# Altium project PiMX8MP_r0.3_release.PrjPcb (part 1 of 6)
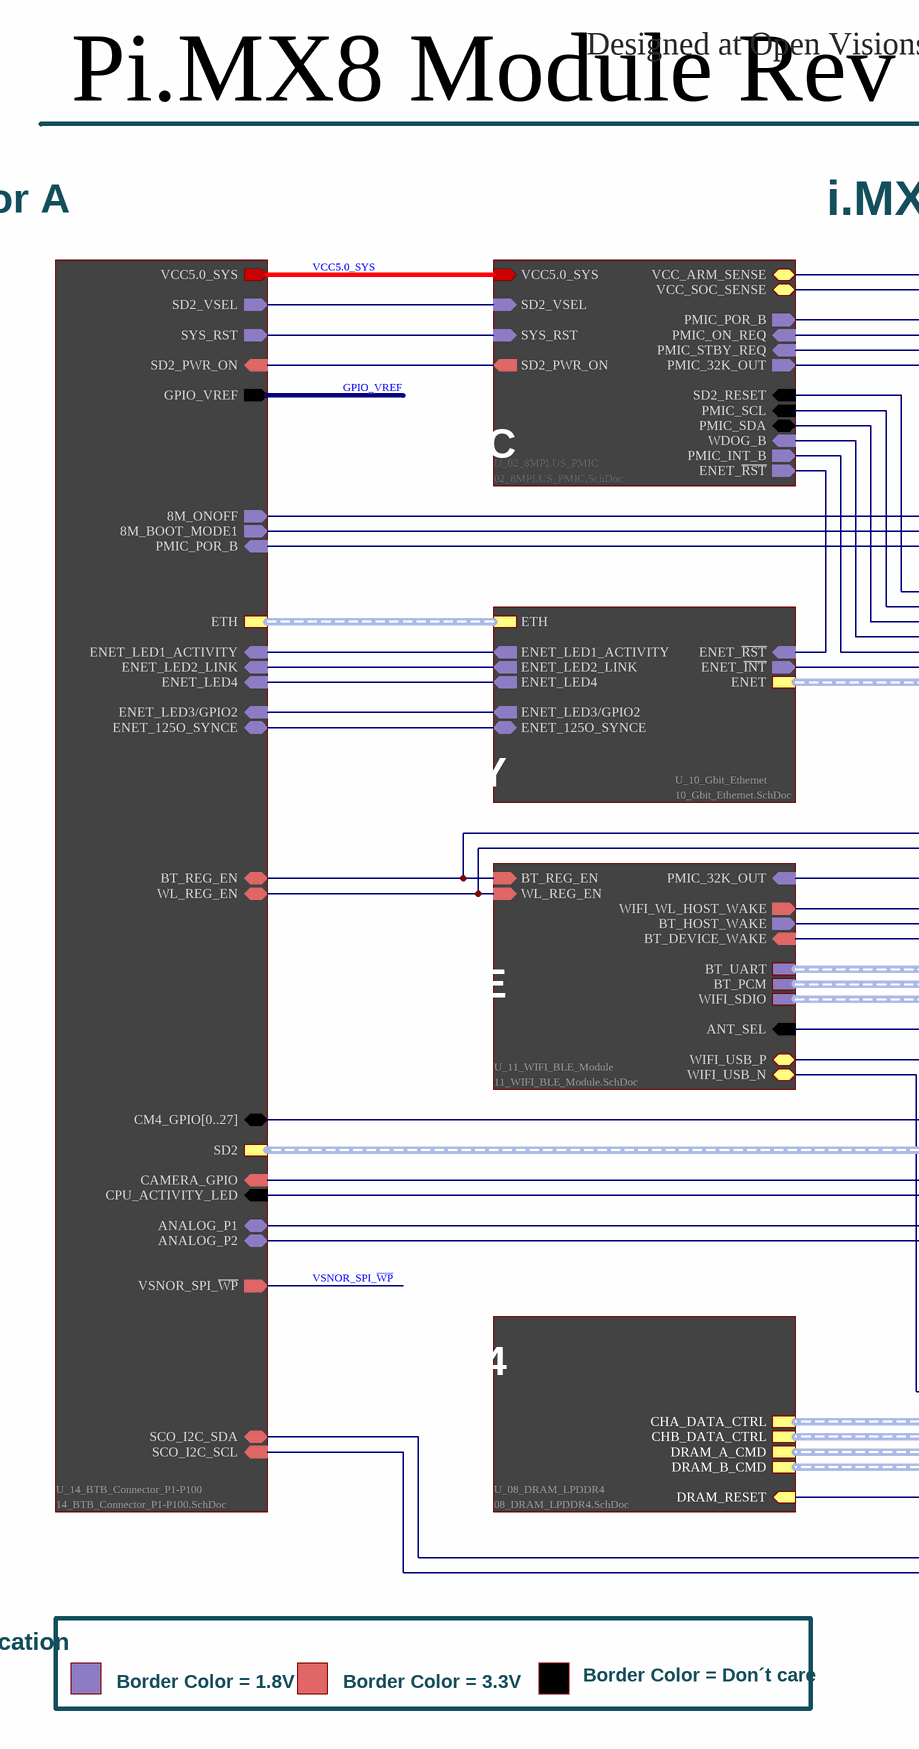
[diagram p0: 01_Block_Diagram.SchDoc, left]
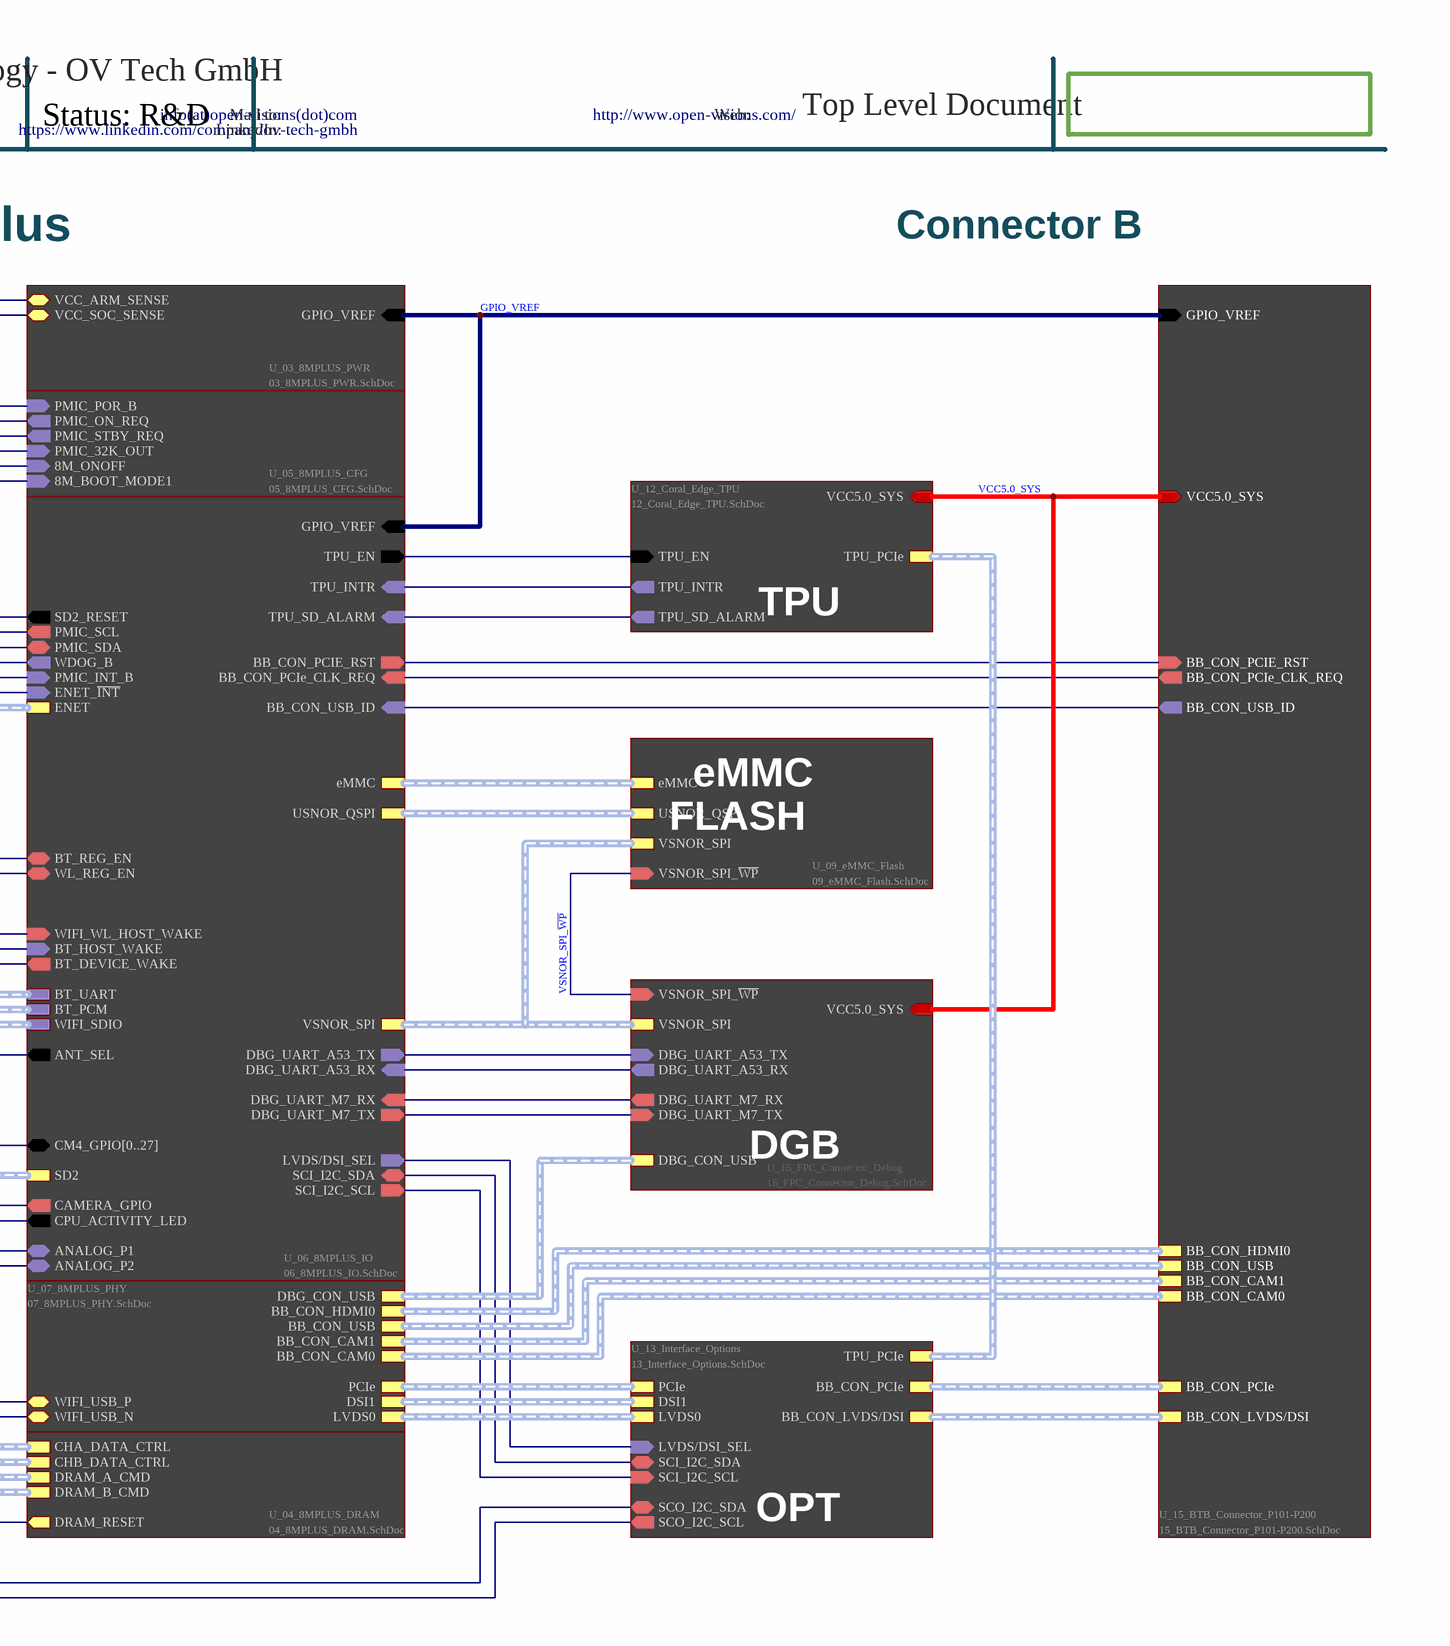
[diagram p1: 01_Block_Diagram.SchDoc, right]
Customer: OV Tech GmbH; DevStatus: Release; License: CERN-OHL-S-2.0; Reviewer: T. Ludemann; Revision: 0.3
16 sheets, 561 parts. Net scope: hierarchical (ports join the sheet entries above them; power ports are global).
Board file: PiMX8MP_r0.3.PcbDoc
Sheets:
  01_Block_Diagram.SchDoc
    U_02_8MPLUS_PMIC = 02_8MPLUS_PMIC.SchDoc
    U_03_8MPLUS_PWR = 03_8MPLUS_PWR.SchDoc
    U_04_8MPLUS_DRAM = 04_8MPLUS_DRAM.SchDoc
    U_05_8MPLUS_CFG = 05_8MPLUS_CFG.SchDoc
    U_06_8MPLUS_IO = 06_8MPLUS_IO.SchDoc
    U_07_8MPLUS_PHY = 07_8MPLUS_PHY.SchDoc
    U_08_DRAM_LPDDR4 = 08_DRAM_LPDDR4.SchDoc
    U_09_eMMC_Flash = 09_eMMC_Flash.SchDoc
    U_10_Gbit_Ethernet = 10_Gbit_Ethernet.SchDoc
    U_11_WIFI_BLE_Module = 11_WIFI_BLE_Module.SchDoc
    U_12_Coral_Edge_TPU = 12_Coral_Edge_TPU.SchDoc
    U_13_Interface_Options = 13_Interface_Options.SchDoc
    U_14_BTB_Connector_P1-P100 = 14_BTB_Connector_P1-P100.SchDoc
    U_15_BTB_Connector_P101-P200 = 15_BTB_Connector_P101-P200.SchDoc
    U_16_FPC_Connector_Debug = 16_FPC_Connector_Debug.SchDoc

## Sheet 01_Block_Diagram.SchDoc: Block_Diagram
size 420 x 297 mm; Author: Lukas Henkel; DocumentNumber: 1; SheetNumber: 1; SheetTotal: 16; DocSize: A3

### Parts
(Parts that share a designator on the sheet are numbered #1, #2 ... from top to bottom, then left to right.)
?#1  (no value)  (graphical)

### Sub-sheets
U_02_8MPLUS_PMIC = 02_8MPLUS_PMIC.SchDoc: VCC_ARM_SENSE (bidir), VCC_SOC_SENSE (bidir), VCC5.0_SYS (in), SD2_VSEL (in), SYS_RST (in), PMIC_ON_REQ (in), PMIC_STBY_REQ (in), WDOG_B (in), PMIC_SCL (in), PMIC_SDA (bidir), PMIC_POR_B (out), PMIC_INT_B (out), PMIC_32K_OUT (out), SD2_PWR_ON (out), SD2_RESET (in), ENET_~{RST} (out)
U_03_8MPLUS_PWR = 03_8MPLUS_PWR.SchDoc: VCC_ARM_SENSE (bidir), VCC_SOC_SENSE (bidir), GPIO_VREF (in)
U_04_8MPLUS_DRAM = 04_8MPLUS_DRAM.SchDoc: CHA_DATA_CTRL (harness CHA_DATA_CTRL), CHB_DATA_CTRL (harness CHB_DATA_CTRL), DRAM_A_CMD (harness DRAM_A_CMD), DRAM_B_CMD (harness DRAM_B_CMD), DRAM_RESET (out)
U_05_8MPLUS_CFG = 05_8MPLUS_CFG.SchDoc: 8M_ONOFF (in), PMIC_POR_B (in), PMIC_ON_REQ (out), PMIC_STBY_REQ (out), PMIC_32K_OUT (in), 8M_BOOT_MODE1 (in)
U_06_8MPLUS_IO = 06_8MPLUS_IO.SchDoc: ENET (harness ENET), SD2 (harness SD2), SD2_RESET (out), ENET_~{INT} (in), WDOG_B (out), PMIC_INT_B (in), WIFI_SDIO (harness WIFI_SDIO), BT_HOST_WAKE (in), BT_DEVICE_WAKE (out), BT_UART (harness BT_UART), BT_PCM (harness BT_PCM), eMMC (harness eMMC), USNOR_QSPI (harness USNOR_QSPI), VSNOR_SPI (harness VSNOR_SPI), TPU_INTR (in), TPU_SD_ALARM (in), WIFI_WL_HOST_WAKE (in), ANT_SEL (out), BB_CON_PCIE_RST (out), BB_CON_PCIe_CLK_REQ (in), SCI_I2C_SDA (bidir), SCI_I2C_SCL (out), CM4_GPIO[0..27] (bidir), ANALOG_P1 (bidir), ANALOG_P2 (bidir), CAMERA_GPIO (out), BB_CON_USB_ID (in), DBG_UART_M7_TX (out), DBG_UART_M7_RX (in), DBG_UART_A53_TX (out), DBG_UART_A53_RX (in), CPU_ACTIVITY_LED (out), GPIO_VREF (in), PMIC_SCL (out), PMIC_SDA (bidir), LVDS/DSI_SEL (out), TPU_EN (out), WL_REG_EN (bidir), BT_REG_EN (bidir)
U_07_8MPLUS_PHY = 07_8MPLUS_PHY.SchDoc: BB_CON_HDMI0 (harness BB_CON_HDMI0), BB_CON_USB (harness BB_CON_USB), PCIe (harness PCIe), BB_CON_CAM1 (harness BB_CON_CAM1), BB_CON_CAM0 (harness BB_CON_CAM0), DSI1 (harness DSI1), LVDS0 (harness LVDS0), DBG_CON_USB (harness DBG_CON_USB), WIFI_USB_P (bidir), WIFI_USB_N (bidir)
U_08_DRAM_LPDDR4 = 08_DRAM_LPDDR4.SchDoc: DRAM_A_CMD (harness DRAM_A_CMD), DRAM_B_CMD (harness DRAM_B_CMD), DRAM_RESET (in), CHA_DATA_CTRL (harness CHA_DATA_CTRL), CHB_DATA_CTRL (harness CHB_DATA_CTRL)
U_09_eMMC_Flash = 09_eMMC_Flash.SchDoc: eMMC (harness eMMC), USNOR_QSPI (harness USNOR_QSPI), VSNOR_SPI (harness VSNOR_SPI), VSNOR_SPI_~{WP} (in)
U_10_Gbit_Ethernet = 10_Gbit_Ethernet.SchDoc: ENET (harness ENET), ENET_~{RST} (in), ENET_~{INT} (out), ETH (harness ETH), ENET_LED4 (out), ENET_LED1_ACTIVITY (out), ENET_LED2_LINK (out), ENET_125O_SYNCE (bidir), ENET_LED3/GPIO2 (out)
U_11_WIFI_BLE_Module = 11_WIFI_BLE_Module.SchDoc: ANT_SEL (in), BT_UART (harness BT_UART), WIFI_WL_HOST_WAKE (out), BT_PCM (harness BT_PCM), WIFI_SDIO (harness WIFI_SDIO), BT_HOST_WAKE (out), BT_DEVICE_WAKE (in), BT_REG_EN (in), WL_REG_EN (in), WIFI_USB_P (bidir), WIFI_USB_N (bidir), PMIC_32K_OUT (in)
U_12_Coral_Edge_TPU = 12_Coral_Edge_TPU.SchDoc: VCC5.0_SYS (in), TPU_EN (in), TPU_INTR (out), TPU_SD_ALARM (out), TPU_PCIe (harness TPU_PCIe)
U_13_Interface_Options = 13_Interface_Options.SchDoc: PCIe (harness PCIe), TPU_PCIe (harness TPU_PCIe), BB_CON_PCIe (harness BB_CON_PCIe), BB_CON_LVDS/DSI (harness BB_CON_LVDS/DSI), DSI1 (harness DSI1), LVDS0 (harness LVDS0), LVDS/DSI_SEL (in), SCI_I2C_SDA (bidir), SCI_I2C_SCL (in), SCO_I2C_SCL (out), SCO_I2C_SDA (bidir)
U_14_BTB_Connector_P1-P100 = 14_BTB_Connector_P1-P100.SchDoc: ETH (harness ETH), ENET_LED4 (in), ENET_LED1_ACTIVITY (in), ENET_LED2_LINK (in), CPU_ACTIVITY_LED (in), ENET_125O_SYNCE (bidir), ENET_LED3/GPIO2 (in), VSNOR_SPI_~{WP} (out), SD2_PWR_ON (in), VCC5.0_SYS (out), BT_REG_EN (bidir), WL_REG_EN (bidir), 8M_BOOT_MODE1 (out), CAMERA_GPIO (in), 8M_ONOFF (out), SD2 (harness SD2), SD2_VSEL (out), GPIO_VREF (out), PMIC_POR_B (in), ANALOG_P1 (bidir), ANALOG_P2 (bidir), CM4_GPIO[0..27] (bidir), SCO_I2C_SCL (in), SCO_I2C_SDA (bidir), SYS_RST (out)
U_15_BTB_Connector_P101-P200 = 15_BTB_Connector_P101-P200.SchDoc: BB_CON_USB (harness BB_CON_USB), BB_CON_USB_ID (out), BB_CON_PCIe (harness BB_CON_PCIe), BB_CON_PCIe_CLK_REQ (out), BB_CON_PCIE_RST (in), BB_CON_CAM1 (harness BB_CON_CAM1), BB_CON_CAM0 (harness BB_CON_CAM0), VCC5.0_SYS (in), BB_CON_HDMI0 (harness BB_CON_HDMI0), BB_CON_LVDS/DSI (harness BB_CON_LVDS/DSI), GPIO_VREF (in)
U_16_FPC_Connector_Debug = 16_FPC_Connector_Debug.SchDoc: DBG_CON_USB (harness DBG_CON_USB), DBG_UART_A53_TX (in), DBG_UART_A53_RX (out), VSNOR_SPI (harness VSNOR_SPI), VSNOR_SPI_~{WP} (in), VCC5.0_SYS (in), DBG_UART_M7_TX (in), DBG_UART_M7_RX (out)

### Nets
8M_BOOT_MODE1: sheet U_05_8MPLUS_CFG/8M_BOOT_MODE1, sheet U_14_BTB_Connector_P1-P100/8M_BOOT_MODE1
8M_ONOFF: sheet U_05_8MPLUS_CFG/8M_ONOFF, sheet U_14_BTB_Connector_P1-P100/8M_ONOFF
ACT_LED_FET: sheet U_10_Gbit_Ethernet/ENET_LED4, sheet U_14_BTB_Connector_P1-P100/ENET_LED4
ANALOG_P1: sheet U_06_8MPLUS_IO/ANALOG_P1, sheet U_14_BTB_Connector_P1-P100/ANALOG_P1
ANALOG_P2: sheet U_06_8MPLUS_IO/ANALOG_P2, sheet U_14_BTB_Connector_P1-P100/ANALOG_P2
ANT_SEL: sheet U_06_8MPLUS_IO/ANT_SEL, sheet U_11_WIFI_BLE_Module/ANT_SEL
BB_CON_PCIe_CLK_REQ: sheet U_06_8MPLUS_IO/BB_CON_PCIe_CLK_REQ, sheet U_15_BTB_Connector_P101-P200/BB_CON_PCIe_CLK_REQ
BB_CON_PCIE_RST: sheet U_06_8MPLUS_IO/BB_CON_PCIE_RST, sheet U_15_BTB_Connector_P101-P200/BB_CON_PCIE_RST
BB_CON_USB_ID: sheet U_06_8MPLUS_IO/BB_CON_USB_ID, sheet U_15_BTB_Connector_P101-P200/BB_CON_USB_ID
BT_DEVICE_WAKE: sheet U_06_8MPLUS_IO/BT_DEVICE_WAKE, sheet U_11_WIFI_BLE_Module/BT_DEVICE_WAKE
BT_HOST_WAKE: sheet U_06_8MPLUS_IO/BT_HOST_WAKE, sheet U_11_WIFI_BLE_Module/BT_HOST_WAKE
BT_REG_EN: sheet U_06_8MPLUS_IO/BT_REG_EN, sheet U_11_WIFI_BLE_Module/BT_REG_EN, sheet U_14_BTB_Connector_P1-P100/BT_REG_EN
CAMERA_GPIO: sheet U_06_8MPLUS_IO/CAMERA_GPIO, sheet U_14_BTB_Connector_P1-P100/CAMERA_GPIO
CON_SCL0: sheet U_13_Interface_Options/SCO_I2C_SCL, sheet U_14_BTB_Connector_P1-P100/SCO_I2C_SCL
CON_SDA0: sheet U_13_Interface_Options/SCO_I2C_SDA, sheet U_14_BTB_Connector_P1-P100/SCO_I2C_SDA
CPU_ACIVITY_LED: sheet U_06_8MPLUS_IO/CPU_ACTIVITY_LED, sheet U_14_BTB_Connector_P1-P100/CPU_ACTIVITY_LED
DBG_UART_A53_RX: sheet U_06_8MPLUS_IO/DBG_UART_A53_RX, sheet U_16_FPC_Connector_Debug/DBG_UART_A53_RX
DBG_UART_A53_TX: sheet U_06_8MPLUS_IO/DBG_UART_A53_TX, sheet U_16_FPC_Connector_Debug/DBG_UART_A53_TX
DBG_UART_M7_RX: sheet U_06_8MPLUS_IO/DBG_UART_M7_RX, sheet U_16_FPC_Connector_Debug/DBG_UART_M7_RX
DBG_UART_M7_TX: sheet U_06_8MPLUS_IO/DBG_UART_M7_TX, sheet U_16_FPC_Connector_Debug/DBG_UART_M7_TX
DRAM_RESET: sheet U_04_8MPLUS_DRAM/DRAM_RESET, sheet U_08_DRAM_LPDDR4/DRAM_RESET
ENET_125O_SYNCE: sheet U_10_Gbit_Ethernet/ENET_125O_SYNCE, sheet U_14_BTB_Connector_P1-P100/ENET_125O_SYNCE
ENET_~{INT}: sheet U_06_8MPLUS_IO/ENET_~{INT}, sheet U_10_Gbit_Ethernet/ENET_~{INT}
ENET_LED1_ACTIVITY: sheet U_10_Gbit_Ethernet/ENET_LED1_ACTIVITY, sheet U_14_BTB_Connector_P1-P100/ENET_LED1_ACTIVITY
ENET_LED2_LINK: sheet U_10_Gbit_Ethernet/ENET_LED2_LINK, sheet U_14_BTB_Connector_P1-P100/ENET_LED2_LINK
ENET_LED3/GPIO2: sheet U_10_Gbit_Ethernet/ENET_LED3/GPIO2, sheet U_14_BTB_Connector_P1-P100/ENET_LED3/GPIO2
ENET_~{RST}: sheet U_02_8MPLUS_PMIC/ENET_~{RST}, sheet U_10_Gbit_Ethernet/ENET_~{RST}
GPIO_VREF: sheet U_03_8MPLUS_PWR/GPIO_VREF, sheet U_06_8MPLUS_IO/GPIO_VREF, sheet U_14_BTB_Connector_P1-P100/GPIO_VREF, sheet U_15_BTB_Connector_P101-P200/GPIO_VREF
LVDS/DSI_SEL: sheet U_06_8MPLUS_IO/LVDS/DSI_SEL, sheet U_13_Interface_Options/LVDS/DSI_SEL
PMIC_32K_OUT: sheet U_02_8MPLUS_PMIC/PMIC_32K_OUT, sheet U_05_8MPLUS_CFG/PMIC_32K_OUT, sheet U_11_WIFI_BLE_Module/PMIC_32K_OUT
PMIC_INT_B: sheet U_02_8MPLUS_PMIC/PMIC_INT_B, sheet U_06_8MPLUS_IO/PMIC_INT_B
PMIC_ON_REQ: sheet U_02_8MPLUS_PMIC/PMIC_ON_REQ, sheet U_05_8MPLUS_CFG/PMIC_ON_REQ
PMIC_POR_B: sheet U_02_8MPLUS_PMIC/PMIC_POR_B, sheet U_05_8MPLUS_CFG/PMIC_POR_B, sheet U_14_BTB_Connector_P1-P100/PMIC_POR_B
PMIC_SCL: sheet U_02_8MPLUS_PMIC/PMIC_SCL, sheet U_06_8MPLUS_IO/PMIC_SCL
PMIC_SDA: sheet U_02_8MPLUS_PMIC/PMIC_SDA, sheet U_06_8MPLUS_IO/PMIC_SDA
PMIC_STBY_REQ: sheet U_02_8MPLUS_PMIC/PMIC_STBY_REQ, sheet U_05_8MPLUS_CFG/PMIC_STBY_REQ
R_SNSP1: sheet U_02_8MPLUS_PMIC/VCC_SOC_SENSE, sheet U_03_8MPLUS_PWR/VCC_SOC_SENSE
R_SNSP2: sheet U_02_8MPLUS_PMIC/VCC_ARM_SENSE, sheet U_03_8MPLUS_PWR/VCC_ARM_SENSE
SCI_I2C_SCL: sheet U_06_8MPLUS_IO/SCI_I2C_SCL, sheet U_13_Interface_Options/SCI_I2C_SCL
SCI_I2C_SDA: sheet U_06_8MPLUS_IO/SCI_I2C_SDA, sheet U_13_Interface_Options/SCI_I2C_SDA
SD2_RESET: sheet U_02_8MPLUS_PMIC/SD2_RESET, sheet U_06_8MPLUS_IO/SD2_RESET
SD2_VSEL: sheet U_02_8MPLUS_PMIC/SD2_VSEL, sheet U_14_BTB_Connector_P1-P100/SD2_VSEL
SD_PWR_ON: sheet U_02_8MPLUS_PMIC/SD2_PWR_ON, sheet U_14_BTB_Connector_P1-P100/SD2_PWR_ON
SYS_RST: sheet U_02_8MPLUS_PMIC/SYS_RST, sheet U_14_BTB_Connector_P1-P100/SYS_RST
TPU_EN: sheet U_06_8MPLUS_IO/TPU_EN, sheet U_12_Coral_Edge_TPU/TPU_EN
TPU_INTR: sheet U_06_8MPLUS_IO/TPU_INTR, sheet U_12_Coral_Edge_TPU/TPU_INTR
TPU_SD_ALARM: sheet U_06_8MPLUS_IO/TPU_SD_ALARM, sheet U_12_Coral_Edge_TPU/TPU_SD_ALARM
VCC5.0_SYS: sheet U_02_8MPLUS_PMIC/VCC5.0_SYS, sheet U_12_Coral_Edge_TPU/VCC5.0_SYS, sheet U_14_BTB_Connector_P1-P100/VCC5.0_SYS, sheet U_15_BTB_Connector_P101-P200/VCC5.0_SYS, sheet U_16_FPC_Connector_Debug/VCC5.0_SYS
VSNOR_SPI_~{WP}: sheet U_09_eMMC_Flash/VSNOR_SPI_~{WP}, sheet U_14_BTB_Connector_P1-P100/VSNOR_SPI_~{WP}, sheet U_16_FPC_Connector_Debug/VSNOR_SPI_~{WP}
WDOG_B: sheet U_02_8MPLUS_PMIC/WDOG_B, sheet U_06_8MPLUS_IO/WDOG_B
WIFI_USB_N: sheet U_07_8MPLUS_PHY/WIFI_USB_N, sheet U_11_WIFI_BLE_Module/WIFI_USB_N
WIFI_USB_P: sheet U_07_8MPLUS_PHY/WIFI_USB_P, sheet U_11_WIFI_BLE_Module/WIFI_USB_P
WIFI_WL_HOST_WAKE: sheet U_06_8MPLUS_IO/WIFI_WL_HOST_WAKE, sheet U_11_WIFI_BLE_Module/WIFI_WL_HOST_WAKE
WL_REG_EN: sheet U_06_8MPLUS_IO/WL_REG_EN, sheet U_11_WIFI_BLE_Module/WL_REG_EN, sheet U_14_BTB_Connector_P1-P100/WL_REG_EN

### Buses and harness runs
bus sheet U_06_8MPLUS_IO/CM4_GPIO[0..27] = sheet U_14_BTB_Connector_P1-P100/CM4_GPIO[0..27]
harness sheet U_04_8MPLUS_DRAM/CHA_DATA_CTRL = sheet U_08_DRAM_LPDDR4/CHA_DATA_CTRL
harness sheet U_04_8MPLUS_DRAM/CHB_DATA_CTRL = sheet U_08_DRAM_LPDDR4/CHB_DATA_CTRL
harness sheet U_04_8MPLUS_DRAM/DRAM_A_CMD = sheet U_08_DRAM_LPDDR4/DRAM_A_CMD
harness sheet U_04_8MPLUS_DRAM/DRAM_B_CMD = sheet U_08_DRAM_LPDDR4/DRAM_B_CMD
harness sheet U_06_8MPLUS_IO/BT_PCM = sheet U_11_WIFI_BLE_Module/BT_PCM
harness sheet U_06_8MPLUS_IO/BT_UART = sheet U_11_WIFI_BLE_Module/BT_UART
harness sheet U_06_8MPLUS_IO/eMMC = sheet U_09_eMMC_Flash/eMMC
harness sheet U_06_8MPLUS_IO/ENET = sheet U_10_Gbit_Ethernet/ENET
harness sheet U_06_8MPLUS_IO/SD2 = sheet U_14_BTB_Connector_P1-P100/SD2
harness sheet U_06_8MPLUS_IO/USNOR_QSPI = sheet U_09_eMMC_Flash/USNOR_QSPI
harness sheet U_06_8MPLUS_IO/VSNOR_SPI = sheet U_09_eMMC_Flash/VSNOR_SPI = sheet U_16_FPC_Connector_Debug/VSNOR_SPI
harness sheet U_06_8MPLUS_IO/WIFI_SDIO = sheet U_11_WIFI_BLE_Module/WIFI_SDIO
harness sheet U_07_8MPLUS_PHY/BB_CON_CAM0 = sheet U_15_BTB_Connector_P101-P200/BB_CON_CAM0
harness sheet U_07_8MPLUS_PHY/BB_CON_CAM1 = sheet U_15_BTB_Connector_P101-P200/BB_CON_CAM1
harness sheet U_07_8MPLUS_PHY/BB_CON_HDMI0 = sheet U_15_BTB_Connector_P101-P200/BB_CON_HDMI0
harness sheet U_07_8MPLUS_PHY/BB_CON_USB = sheet U_15_BTB_Connector_P101-P200/BB_CON_USB
harness sheet U_07_8MPLUS_PHY/DBG_CON_USB = sheet U_16_FPC_Connector_Debug/DBG_CON_USB
harness sheet U_07_8MPLUS_PHY/DSI1 = sheet U_13_Interface_Options/DSI1
harness sheet U_07_8MPLUS_PHY/LVDS0 = sheet U_13_Interface_Options/LVDS0
harness sheet U_07_8MPLUS_PHY/PCIe = sheet U_13_Interface_Options/PCIe
harness sheet U_10_Gbit_Ethernet/ETH = sheet U_14_BTB_Connector_P1-P100/ETH
harness sheet U_12_Coral_Edge_TPU/TPU_PCIe = sheet U_13_Interface_Options/TPU_PCIe
harness sheet U_13_Interface_Options/BB_CON_LVDS/DSI = sheet U_15_BTB_Connector_P101-P200/BB_CON_LVDS/DSI
harness sheet U_13_Interface_Options/BB_CON_PCIe = sheet U_15_BTB_Connector_P101-P200/BB_CON_PCIe

### Notes on the sheet
- Pi.MX8 Module Rev 0.3
- Status: R&D
- Designed at Open Visions Technology - OV Tech GmbH
- Mail to:
- LinkedIn:
- info(at)open-visions(dot)com
- https://www.linkedin.com/company/ov-tech-gmbh
- Web:
- http://www.open-visions.com/
- Top Level Document
- Connector A
- i.MX 8M Plus
- Connector B
- PMIC
- TPU
- GBit PHY
- FLASH
- eMMC
- WIFI/BLE
- DGB
- LPDDR4
- OPT
- Signal Level Indication
- Border Color = 1.8V
- Border Color = 3.3V
- Border Color = Don´t care
- OV Tech GmbH - Open Visions Technology

### Library data of the parts
?#1 = Titleblock_01_OpenSource

## Sheet 02_8MPLUS_PMIC.SchDoc: 8MPLUS_PMIC
size 420 x 297 mm; Author: Lukas Henkel; DocumentNumber: 2; SheetNumber: 2; SheetTotal: 16; DocSize: A3
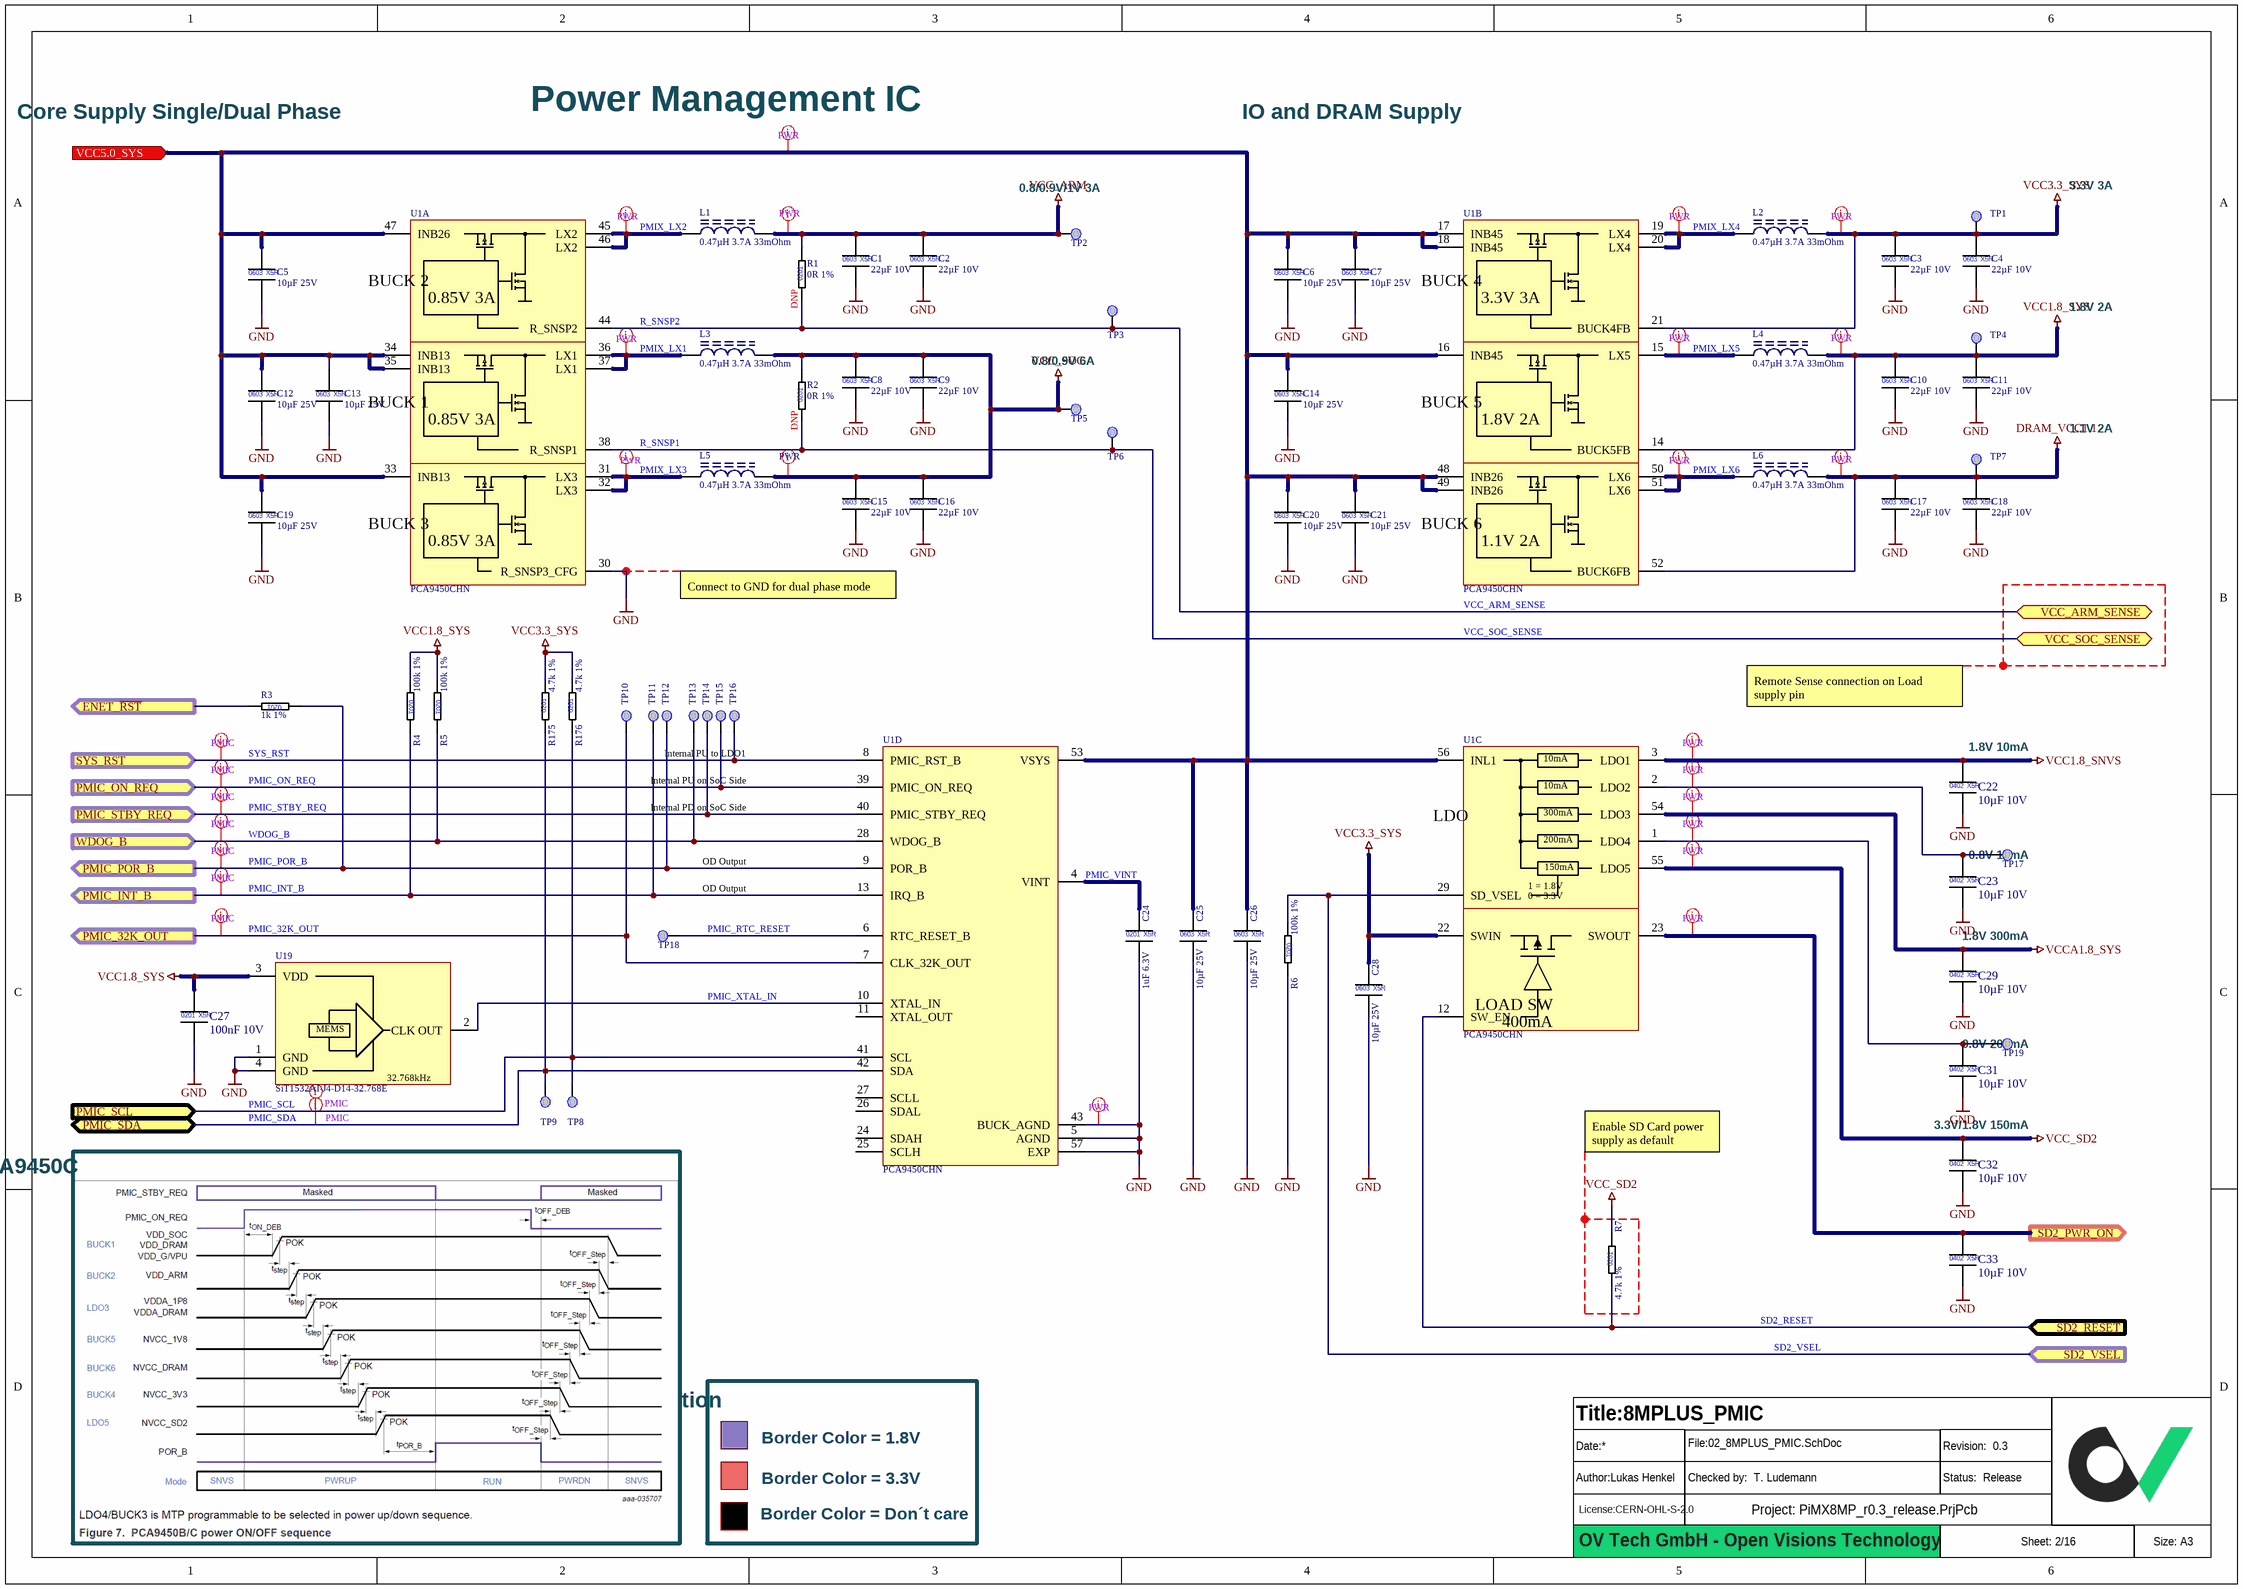
[diagram p2: 02_8MPLUS_PMIC.SchDoc]

### Parts
(Parts that share a designator on the sheet are numbered #1, #2 ... from top to bottom, then left to right.)
?#2  (no value)  (graphical)
C1  22µF 10V  [CAPC1608X10L]
C2  22µF 10V  [CAPC1608X10L]
C3  22µF 10V  [CAPC1608X10L]
C4  22µF 10V  [CAPC1608X10L]
C5  10µF 25V  [CAPC1608X10L]
C6  10µF 25V  [CAPC1608X10L]
C7  10µF 25V  [CAPC1608X10L]
C8  22µF 10V  [CAPC1608X10L]
C9  22µF 10V  [CAPC1608X10L]
C10  22µF 10V  [CAPC1608X10L]
C11  22µF 10V  [CAPC1608X10L]
C12  10µF 25V  [CAPC1608X10L]
C13  10µF 25V  [CAPC1608X10L]
C14  10µF 25V  [CAPC1608X10L]
C15  22µF 10V  [CAPC1608X10L]
C16  22µF 10V  [CAPC1608X10L]
C17  22µF 10V  [CAPC1608X10L]
C18  22µF 10V  [CAPC1608X10L]
C19  10µF 25V  [CAPC1608X10L]
C20  10µF 25V  [CAPC1608X10L]
C21  10µF 25V  [CAPC1608X10L]
C22  10µF 10V  [CAPC1005X06L]
C23  10µF 10V  [CAPC1005X06L]
C24  1uF 6.3V  [CAPC0603X03L]
C25  10µF 25V  [CAPC1608X10L]
C26  10µF 25V  [CAPC1608X10L]
C27  100nF 10V  [CAPC0603X03L]
C28  10µF 25V  [CAPC1608X10L]
C29  10µF 10V  [CAPC1005X06L]
C31  10µF 10V  [CAPC1005X06L]
C32  10µF 10V  [CAPC1005X06L]
C33  10µF 10V  [CAPC1005X06L]
L1  0.47µH 3.7A 33mOhm  [INDC2016X12L]
L2  0.47µH 3.7A 33mOhm  [INDC2016X12L]
L3  0.47µH 3.7A 33mOhm  [INDC2016X12L]
L4  0.47µH 3.7A 33mOhm  [INDC2016X12L]
L5  0.47µH 3.7A 33mOhm  [INDC2016X12L]
L6  0.47µH 3.7A 33mOhm  [INDC2016X12L]
R1  0R 1%  [RESC0603X03L]
R2  0R 1%  [RESC0603X03L]
R3  1k 1%  [RESC0603X03L]
R4  100k 1%  [RESC0603X03L]
R5  100k 1%  [RESC0603X03L]
R6  100k 1%  [RESC0603X03L]
R7  4.7k 1%  [RESC0603X03L]
R175  4.7k 1%  [RESC0603X03L]
R176  4.7k 1%  [RESC0603X03L]
TP1  Testpoint 0.5mm  [TP_0.50mm]  (value not drawn)  (no BOM)
TP2  Testpoint 0.5mm  [TP_0.50mm]  (value not drawn)  (no BOM)
TP3  Testpoint 0.5mm  [TP_0.50mm]  (value not drawn)  (no BOM)
TP4  Testpoint 0.5mm  [TP_0.50mm]  (value not drawn)  (no BOM)
TP5  Testpoint 0.5mm  [TP_0.50mm]  (value not drawn)  (no BOM)
TP6  Testpoint 0.5mm  [TP_0.50mm]  (value not drawn)  (no BOM)
TP7  Testpoint 0.5mm  [TP_0.50mm]  (value not drawn)  (no BOM)
TP8  Testpoint 0.5mm  [TP_0.50mm]  (value not drawn)  (no BOM)
TP9  Testpoint 0.5mm  [TP_0.50mm]  (value not drawn)  (no BOM)
TP10  Testpoint 0.5mm  [TP_0.50mm]  (value not drawn)  (no BOM)
TP11  Testpoint 0.5mm  [TP_0.50mm]  (value not drawn)  (no BOM)
TP12  Testpoint 0.5mm  [TP_0.50mm]  (value not drawn)  (no BOM)
TP13  Testpoint 0.5mm  [TP_0.50mm]  (value not drawn)  (no BOM)
TP14  Testpoint 0.5mm  [TP_0.50mm]  (value not drawn)  (no BOM)
TP15  Testpoint 0.5mm  [TP_0.50mm]  (value not drawn)  (no BOM)
TP16  Testpoint 0.5mm  [TP_0.50mm]  (value not drawn)  (no BOM)
TP17  Testpoint 0.5mm  [TP_0.50mm]  (value not drawn)  (no BOM)
TP18  Testpoint 0.5mm  [TP_0.50mm]  (value not drawn)  (no BOM)
TP19  Testpoint 0.5mm  [TP_0.50mm]  (value not drawn)  (no BOM)
U1  PCA9450CHN  [QFN40P700X700X100_HS-57L]  (parts A,B,C,D of 4)
U19  SiT1532AI-J4-D14-32.768E  [OSCILLATOR_SITIME_SiT1532AI-J4-D14-32.768E]

### Ports
ENET_~{RST} (out), PMIC_32K_OUT (out), PMIC_INT_B (out), PMIC_ON_REQ (in), PMIC_POR_B (out), PMIC_SCL (in), PMIC_SDA (bidir), PMIC_STBY_REQ (in), SD2_PWR_ON (out), SD2_RESET (in), SD2_VSEL (in), SYS_RST (in), VCC5.0_SYS (in), VCC_ARM_SENSE (bidir), VCC_SOC_SENSE (bidir), WDOG_B (in)

### Nets
DRAM_VCC1.1: C17.1 C18.1 L6.2 TP7.TP U1.52(BUCK6FB)
GND: C1.2 C2.2 C3.2 C4.2 C5.2 C6.2 C7.2 C8.2 C9.2 C10.2 C11.2 C12.2 C13.2 C14.2 C15.2 C16.2 C17.2 C18.2 C19.2 C20.2 C21.2 C22.2 C23.2 C24.2 C25.2 C26.2 C27.2 C28.2 C29.2 C31.2 C32.2 C33.2 R6.2 U1.5(AGND) U1.30(R_SNSP3_CFG) U1.43(BUCK_AGND) U1.57(EXP) U19.1(GND) U19.4(GND)
VCC1.8_SNVS: C22.1 U1.3(LDO1)
VCC1.8_SYS: C10.1 C11.1 C27.1 L4.2 R4.1 R5.1 TP4.TP U1.14(BUCK5FB) U19.3(VDD)
VCC3.3_SYS: C3.1 C4.1 C28.1 L2.2 R175.2 R176.2 TP1.TP U1.21(BUCK4FB) U1.22(SWIN)
VCC_ARM: C1.1 C2.1 L1.2 R1.2 TP2.TP
VCC_SD2: C32.1 R7.2 U1.55(LDO5)
VCC_SOC: C8.1 C9.1 C15.1 C16.1 L3.2 L5.2 R2.2 TP5.TP
VCCA1.8_SYS: C29.1 U1.54(LDO3)
ENET_~{RST}: R3.2 ; port ENET_~{RST}
PMIC_32K_OUT: TP10.TP U1.7(CLK_32K_OUT) ; port PMIC_32K_OUT
PMIC_INT_B: R4.2 TP11.TP U1.13(IRQ_B) ; port PMIC_INT_B
PMIC_ON_REQ: TP15.TP U1.39(PMIC_ON_REQ) ; port PMIC_ON_REQ
PMIC_POR_B: R3.1 TP12.TP U1.9(POR_B) ; port PMIC_POR_B
PMIC_RTC_RESET: TP18.TP U1.6(RTC_RESET_B)
PMIC_SCL: R176.1 TP8.TP U1.41(SCL) ; port PMIC_SCL
PMIC_SDA: R175.1 TP9.TP U1.42(SDA) ; port PMIC_SDA
PMIC_STBY_REQ: TP14.TP U1.40(PMIC_STBY_REQ) ; port PMIC_STBY_REQ
PMIC_VINT: C24.1 U1.4(VINT)
PMIC_XTAL_IN: U1.10(XTAL_IN) U19.2(CLK_OUT)
PMIX_LX1: L3.1 U1.36(LX1) U1.37(LX1)
PMIX_LX2: L1.1 U1.45(LX2) U1.46(LX2)
PMIX_LX3: L5.1 U1.31(LX3) U1.32(LX3)
PMIX_LX4: L2.1 U1.19(LX4) U1.20(LX4)
PMIX_LX5: L4.1 U1.15(LX5)
PMIX_LX6: L6.1 U1.50(LX6) U1.51(LX6)
R_SNSP1: R2.1 TP6.TP U1.38(R_SNSP1) ; port VCC_SOC_SENSE  [also labelled VCC_SOC_SENSE]
R_SNSP2: R1.1 TP3.TP U1.44(R_SNSP2) ; port VCC_ARM_SENSE  [also labelled VCC_ARM_SENSE]
SD2_RESET: R7.1 U1.12(SW_EN) ; port SD2_RESET
SD2_VSEL: R6.1 U1.29(SD_VSEL) ; port SD2_VSEL
SD_PWR_ON: C33.1 U1.23(SWOUT) ; port SD2_PWR_ON
SYS_RST: TP16.TP U1.8(PMIC_RST_B) ; port SYS_RST
VCC5.0_SYS: C5.1 C6.1 C7.1 C12.1 C13.1 C14.1 C19.1 C20.1 C21.1 C25.1 C26.1 U1.16(INB45) U1.17(INB45) U1.18(INB45) U1.33(INB13) U1.34(INB13) U1.35(INB13) U1.47(INB26) U1.48(INB26) U1.49(INB26) U1.53(VSYS) U1.56(INL1) ; port VCC5.0_SYS
WDOG_B: R5.2 TP13.TP U1.28(WDOG_B) ; port WDOG_B
NetC23_1: C23.1 TP17.TP U1.2(LDO2)
NetC31_1: C31.1 TP19.TP U1.1(LDO4)

Not connected (* = marked no-connect by the designer): U1 11(XTAL_OUT) 24(SDAH) 25(SCLH) 26(SDAL) 27(SCLL)

### Layout directives
net class PWR: DRAM_VCC1.1, GND, NetC23_1, NetC31_1, PMIX_LX1, PMIX_LX2, PMIX_LX3, PMIX_LX4, PMIX_LX5, PMIX_LX6, SD_PWR_ON, VCC1.8_SNVS, VCC1.8_SYS, VCC3.3_SYS, VCC5.0_SYS, VCC_ARM, VCC_SD2, VCC_SOC, VCCA1.8_SYS
net class PMIC: PMIC_32K_OUT, PMIC_INT_B, PMIC_ON_REQ, PMIC_POR_B, PMIC_SCL, PMIC_SDA, PMIC_STBY_REQ, SYS_RST, WDOG_B

### Notes on the sheet
- Core Supply Single/Dual Phase
- Power Management IC
- IO and DRAM Supply
- (near TP2) 0.8/0.9V/1V 3A
- 3.3V 3A
- (near R1) DNP
- 1.8V 2A
- 0.8/0.9V 6A
- (near R2) DNP
- 1.1V 2A
- Connect to GND for dual phase mode
- Remote Sense connection on Load supply pin
- Internal PU to LDO1
- (near U1) Internal PU on SoC Side
- 1.8V 10mA
- (near U1) Internal PD on SoC Side
- OD Output
- (near TP17) 0.8V 10mA
- 1.8V 300mA
- (near TP19) 0.8V 200mA
- 3.3V/1.8V 150mA
- Power Sequencing PCA9450C
- Enable SD Card power supply as default
- Signal Level Indication
- Border Color = 1.8V
- Border Color = Don´t care
- Border Color = 3.3V
- OV Tech GmbH - Open Visions Technology
- (in symbol CAP_0201_1uF_6.3V) 0201; X5R
- (in symbol CAP_0201_100nF_10V) 0201; X5R
- (in symbol CAP_0402_10µ_10V) 0402; X5R
- (in symbol CAP_0603_10µ_25V) 0603; X5R
- (in symbol CAP_0603_22µ_10V) 0603; X5R
- (in symbol MEMS Oscillator_SiTime_SiT1532AI-J4-D14-32.768E) MEMS; 32.768kHz
- (in symbol PMIC 6A 5.5V_PCA9450CHN, part A) BUCK 2; 0.85V 3A; BUCK 1; BUCK 3
- (in symbol PMIC 6A 5.5V_PCA9450CHN, part B) BUCK 4; 3.3V 3A; BUCK 5; 1.8V 2A; BUCK 6; 1.1V 2A
- (in symbol PMIC 6A 5.5V_PCA9450CHN, part C) 10mA; LDO; 300mA; 200mA; 150mA; 1 = 1.8V; 0 = 3.3V; LOAD SW; 400mA
- (in symbol RES_0201_0R_1%) 0201
- (in symbol RES_0201_1k_1%) 0201
- (in symbol RES_0201_4.7k_1%) 0201
- (in symbol RES_0201_100k_1%) 0201

### Library data of the parts
?#2 = Titleblock_01_OpenSource
C1-C4 C8-C11 C15-C18 = CAP_0603_22µ_10V: Multilayer Ceramic Capacitors MLCC - SMD/SMT 0603 10VDC; Manufacturer 1: Murata Electronics; Manufacturer 1 Prt. Nr.: GRM188R61A226ME15D; Manufacturer 2 Prt. Nr.: CL10A226MP8NRNC; Manufacturer 2: Samsung Electro-Mechanics
C5-C7 C12-C14 C19-C21 C25 C26 C28 = CAP_0603_10µ_25V: Multilayer Ceramic Capacitors MLCC - SMD/SMT 0603 25VDC; Manufacturer 1: Murata Electronics; Manufacturer 1 Prt. Nr.: GRM188R61E106KA73J; Manufacturer 2 Prt. Nr.: CL10A106MA8NRNC; Manufacturer 2: Samsung Electro-Mechanics
C22 C23 C29 C31-C33 = CAP_0402_10µ_10V: Multilayer Ceramic Capacitors MLCC - SMD/SMT 0402 10VDC; Manufacturer 1: Murata Electronics; Manufacturer 1 Prt. Nr.: GRM155R61A106ME11D; Manufacturer 2 Prt. Nr.: 0402ZD106MAT4A; Manufacturer 2: KYOCERA AVX
C24 = CAP_0201_1uF_6.3V: Multilayer Ceramic Capacitors MLCC - SMD/SMT 0201 6.3VDC; Manufacturer 1: Murata Electronics; Manufacturer 1 Prt. Nr.: GRM033R60J105MEA2D; Manufacturer 2 Prt. Nr.: CL03A105MQ3CSNC; Manufacturer 2: Samsung Electro-Mechanics
C27 = CAP_0201_100nF_10V: Multilayer Ceramic Capacitors MLCC - SMD/SMT 0201 10VDC; Manufacturer 1: Murata Electronics; Manufacturer 1 Prt. Nr.: GRT033R61A104KE01J; Manufacturer 2 Prt. Nr.: CL03A104MP3NNNC; Manufacturer 2: Samsung Electro-Mechanics
L1-L6 = IND_DFE-P 2016_0.47µH_3.7A: Fixed Inductors DFE-P 2016 0.47uH 3.7A 20% 33mOhms HiCur; Manufacturer 1 Prt. Nr.: DFE201612P-R47M=P2; Manufacturer 1: Murata Electronics
R1 R2 = RES_0201_0R_1%: Thick Film Resistors - SMD 0R OHM 1%; Manufacturer 1: Yageo; Manufacturer 1 Prt. Nr.: RC0201FR-070RL; Manufacturer 2 Prt. Nr.: CRCW02010000Z0ED; Manufacturer 2: Vishay / Dale
R3 = RES_0201_1k_1%: Thick Film Resistors - SMD 1K OHM 1%; Manufacturer 1: Yageo; Manufacturer 1 Prt. Nr.: RC0201FR-071KL; Manufacturer 2 Prt. Nr.: CRCW02011K00FNED; Manufacturer 2: Vishay / Dale
R4-R6 = RES_0201_100k_1%: Thick Film Resistors - SMD 100K OHM 1%; Manufacturer 1: Yageo; Manufacturer 1 Prt. Nr.: RC0201FR-07100KL; Manufacturer 2 Prt. Nr.: CRCW0201100KFNED; Manufacturer 2: Vishay / Dale
R7 R175 R176 = RES_0201_4.7k_1%: Thick Film Resistors - SMD 4.7K OHM 1%; Manufacturer 1: Yageo; Manufacturer 1 Prt. Nr.: RC0201JR-074K7P; Manufacturer 2 Prt. Nr.: CRCW02014K70FNED; Manufacturer 2: Vishay / Dale
U1 = PMIC 6A 5.5V_PCA9450CHN: 5.5V, 6A, Low I Q ,Synchronous Buck Converter PMIC; Manufacturer 1: NXP Semiconductors; Manufacturer 1 Prt. Nr.: PCA9450CHN
U19 = MEMS Oscillator_SiTime_SiT1532AI-J4-D14-32.768E: 10 ppm Ultra-Low Power 32.768 kHz XTAL Replacement; Manufacturer 1: SiTime; Manufacturer 1 Prt. Nr.: SiT1532AI-J4-D14-32.768E

## Sheet 03_8MPLUS_PWR.SchDoc: 8MPLUS_PWR
size 420 x 297 mm; Author: Lukas Henkel; DocumentNumber: 3; SheetNumber: 3; SheetTotal: 16; DocSize: A3
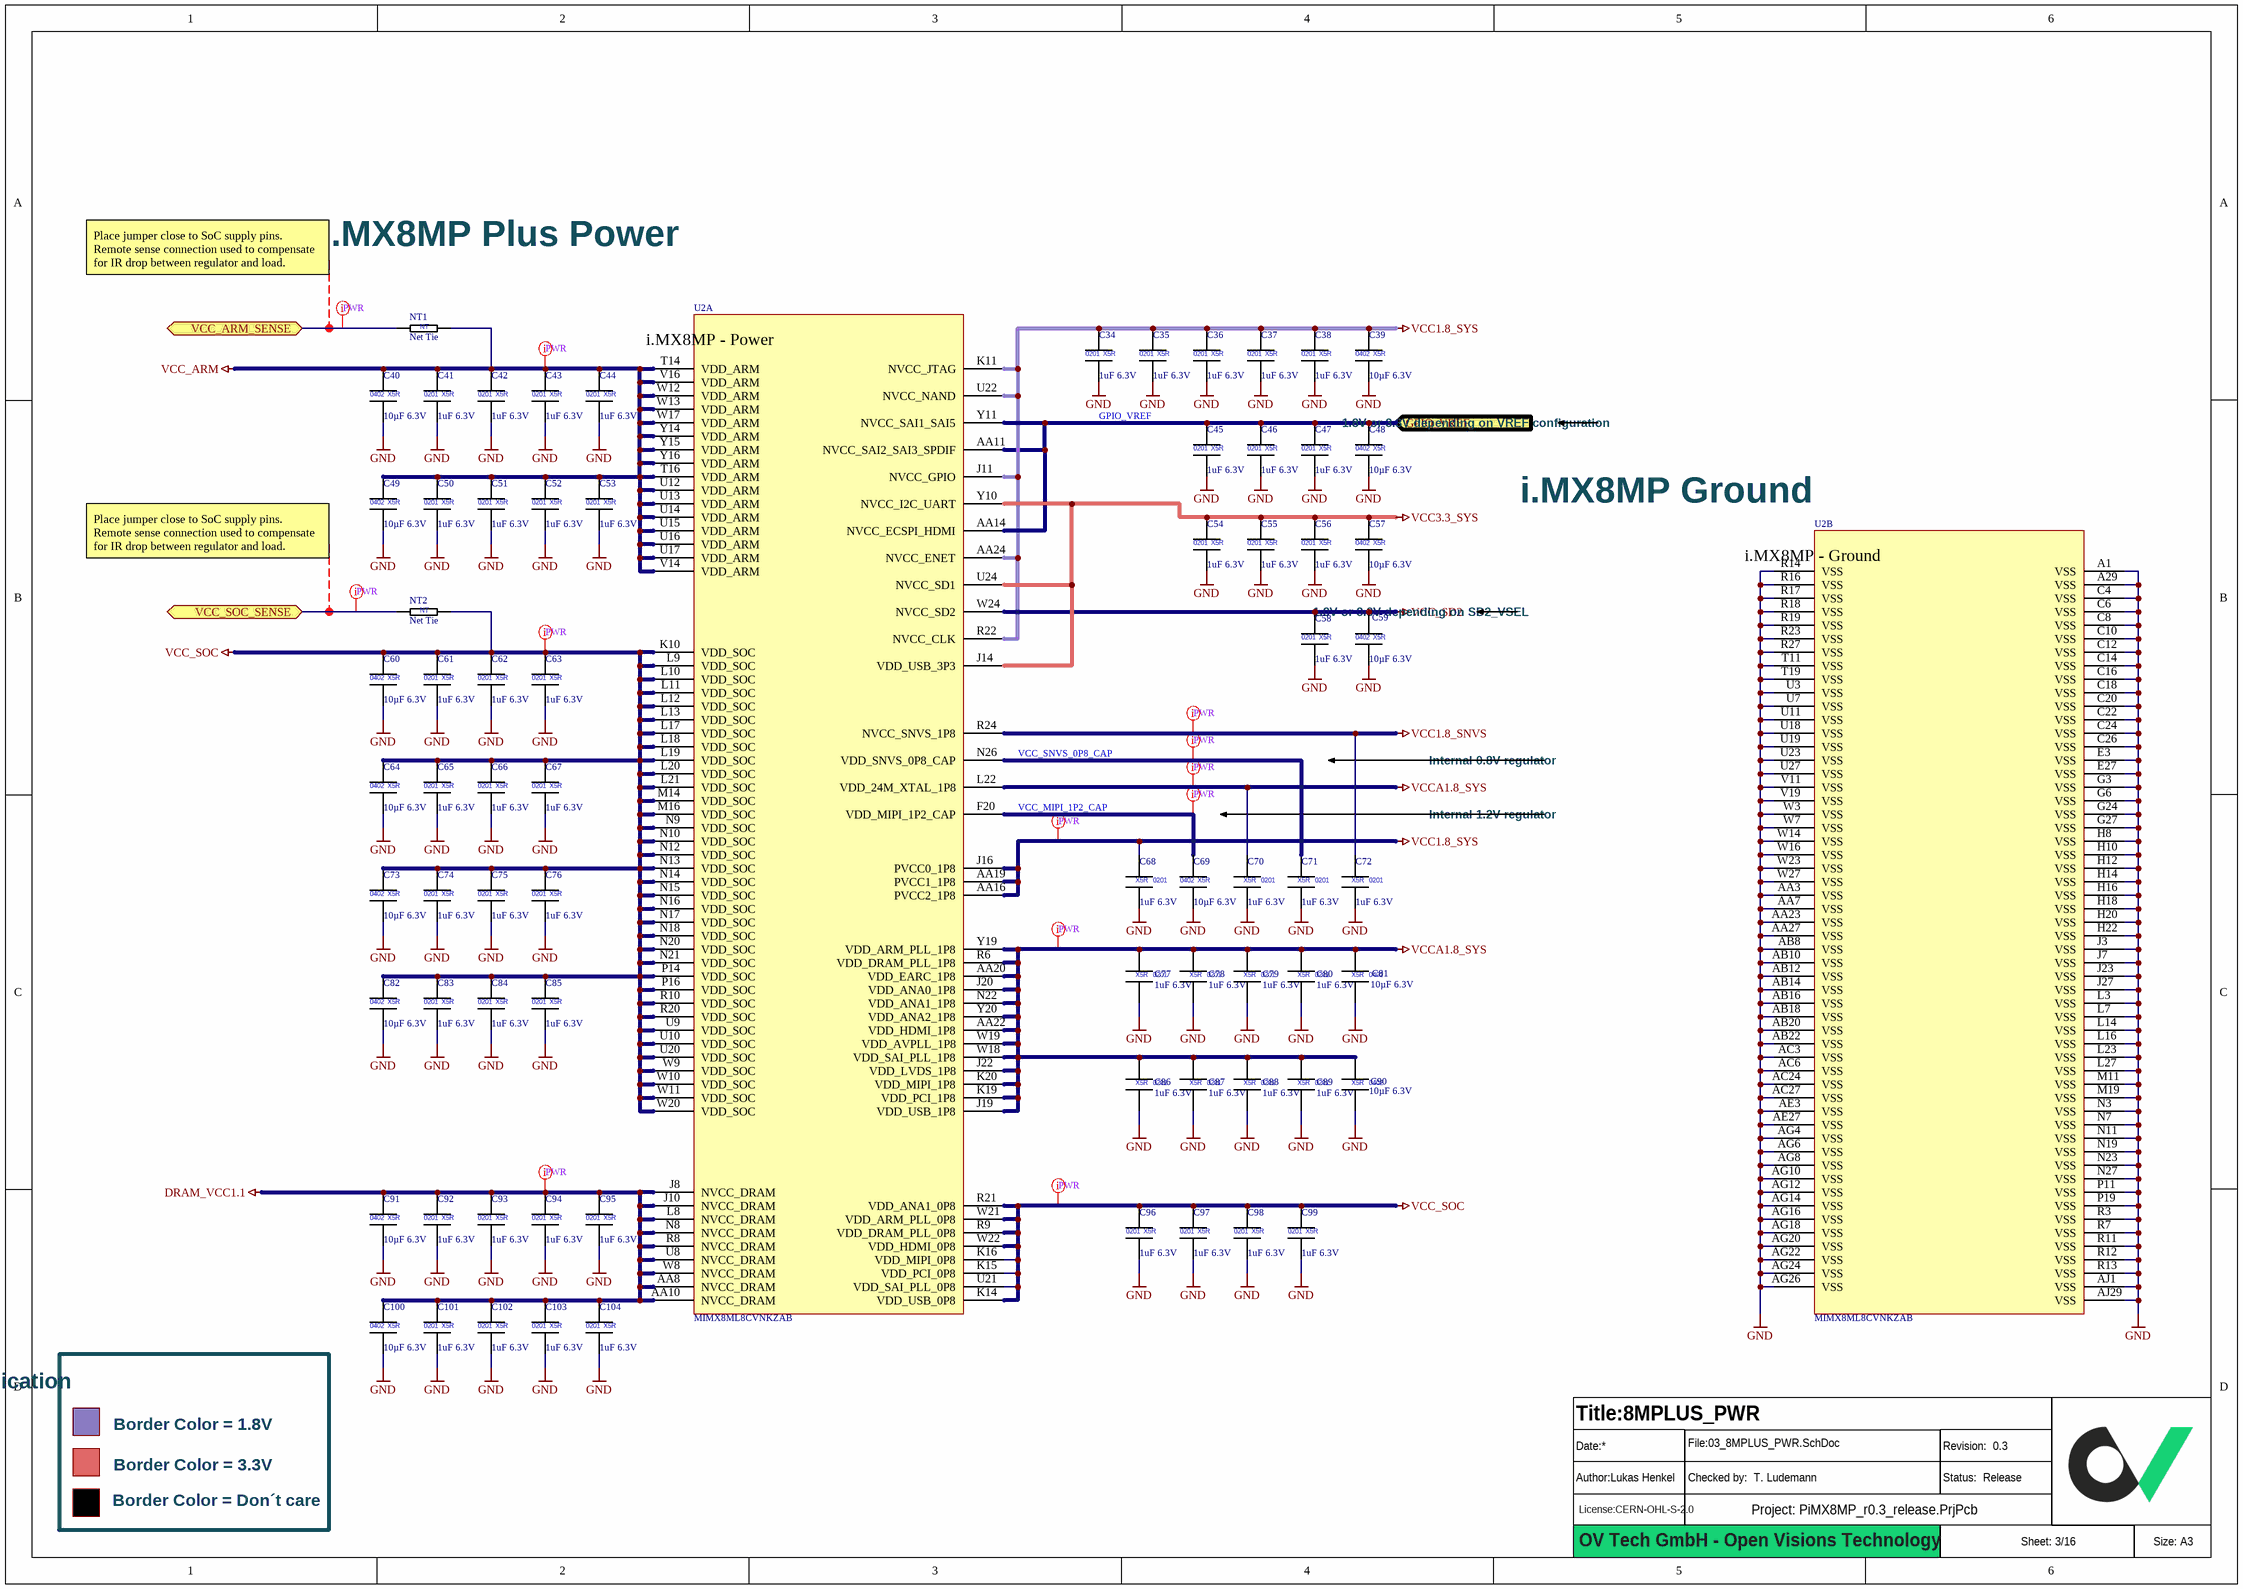
[diagram p3: 03_8MPLUS_PWR.SchDoc]

### Parts
(Parts that share a designator on the sheet are numbered #1, #2 ... from top to bottom, then left to right.)
?#3  (no value)  (graphical)
C34  1uF 6.3V  [CAPC0603X03L]
C35  1uF 6.3V  [CAPC0603X03L]
C36  1uF 6.3V  [CAPC0603X03L]
C37  1uF 6.3V  [CAPC0603X03L]
C38  1uF 6.3V  [CAPC0603X03L]
C39  10µF 6.3V  [CAPC1005X06L]
C40  10µF 6.3V  [CAPC1005X06L]
C41  1uF 6.3V  [CAPC0603X03L]
C42  1uF 6.3V  [CAPC0603X03L]
C43  1uF 6.3V  [CAPC0603X03L]
C44  1uF 6.3V  [CAPC0603X03L]
C45  1uF 6.3V  [CAPC0603X03L]
C46  1uF 6.3V  [CAPC0603X03L]
C47  1uF 6.3V  [CAPC0603X03L]
C48  10µF 6.3V  [CAPC1005X06L]
C49  10µF 6.3V  [CAPC1005X06L]
C50  1uF 6.3V  [CAPC0603X03L]
C51  1uF 6.3V  [CAPC0603X03L]
C52  1uF 6.3V  [CAPC0603X03L]
C53  1uF 6.3V  [CAPC0603X03L]
C54  1uF 6.3V  [CAPC0603X03L]
C55  1uF 6.3V  [CAPC0603X03L]
C56  1uF 6.3V  [CAPC0603X03L]
C57  10µF 6.3V  [CAPC1005X06L]
C58  1uF 6.3V  [CAPC0603X03L]
C59  10µF 6.3V  [CAPC1005X06L]
C60  10µF 6.3V  [CAPC1005X06L]
C61  1uF 6.3V  [CAPC0603X03L]
C62  1uF 6.3V  [CAPC0603X03L]
C63  1uF 6.3V  [CAPC0603X03L]
C64  10µF 6.3V  [CAPC1005X06L]
C65  1uF 6.3V  [CAPC0603X03L]
C66  1uF 6.3V  [CAPC0603X03L]
C67  1uF 6.3V  [CAPC0603X03L]
C68  1uF 6.3V  [CAPC0603X03L]
C69  10µF 6.3V  [CAPC1005X06L]
C70  1uF 6.3V  [CAPC0603X03L]
C71  1uF 6.3V  [CAPC0603X03L]
C72  1uF 6.3V  [CAPC0603X03L]
C73  10µF 6.3V  [CAPC1005X06L]
C74  1uF 6.3V  [CAPC0603X03L]
C75  1uF 6.3V  [CAPC0603X03L]
C76  1uF 6.3V  [CAPC0603X03L]
C77  1uF 6.3V  [CAPC0603X03L]
C78  1uF 6.3V  [CAPC0603X03L]
C79  1uF 6.3V  [CAPC0603X03L]
C80  1uF 6.3V  [CAPC0603X03L]
C81  10µF 6.3V  [CAPC1005X06L]
C82  10µF 6.3V  [CAPC1005X06L]
C83  1uF 6.3V  [CAPC0603X03L]
C84  1uF 6.3V  [CAPC0603X03L]
C85  1uF 6.3V  [CAPC0603X03L]
C86  1uF 6.3V  [CAPC0603X03L]
C87  1uF 6.3V  [CAPC0603X03L]
C88  1uF 6.3V  [CAPC0603X03L]
C89  1uF 6.3V  [CAPC0603X03L]
C90  10µF 6.3V  [CAPC1005X06L]
C91  10µF 6.3V  [CAPC1005X06L]
C92  1uF 6.3V  [CAPC0603X03L]
C93  1uF 6.3V  [CAPC0603X03L]
C94  1uF 6.3V  [CAPC0603X03L]
C95  1uF 6.3V  [CAPC0603X03L]
C96  1uF 6.3V  [CAPC0603X03L]
C97  1uF 6.3V  [CAPC0603X03L]
C98  1uF 6.3V  [CAPC0603X03L]
C99  1uF 6.3V  [CAPC0603X03L]
C100  10µF 6.3V  [CAPC1005X06L]
C101  1uF 6.3V  [CAPC0603X03L]
C102  1uF 6.3V  [CAPC0603X03L]
C103  1uF 6.3V  [CAPC0603X03L]
C104  1uF 6.3V  [CAPC0603X03L]
NT1  Net Tie  [Net_Tie_0.2mm]  (net tie, no BOM)
NT2  Net Tie  [Net_Tie_0.2mm]  (net tie, no BOM)
U2  MIMX8ML8CVNKZAB  [BGA548C50P29X29_1500X1500X148]  (parts A,B of 15)

### Ports
GPIO_VREF (in), VCC_ARM_SENSE (bidir), VCC_SOC_SENSE (bidir)

### Nets
DRAM_VCC1.1: C91.1 C92.1 C93.1 C94.1 C95.1 C100.1 C101.1 C102.1 C103.1 C104.1 U2.AA8(NVCC_DRAM) U2.AA10(NVCC_DRAM) U2.J8(NVCC_DRAM) U2.J10(NVCC_DRAM) U2.L8(NVCC_DRAM) U2.N8(NVCC_DRAM) U2.R8(NVCC_DRAM) U2.U8(NVCC_DRAM) U2.W8(NVCC_DRAM)
GND: C34.2 C35.2 C36.2 C37.2 C38.2 C39.2 C40.2 C41.2 C42.2 C43.2 C44.2 C45.2 C46.2 C47.2 C48.2 C49.2 C50.2 C51.2 C52.2 C53.2 C54.2 C55.2 C56.2 C57.2 C58.2 C59.2 C60.2 C61.2 C62.2 C63.2 C64.2 C65.2 C66.2 C67.2 C68.2 C69.2 C70.2 C71.2 C72.2 C73.2 C74.2 C75.2 C76.2 C77.2 C78.2 C79.2 C80.2 C81.2 C82.2 C83.2 C84.2 C85.2 C86.2 C87.2 C88.2 C89.2 C90.2 C91.2 C92.2 C93.2 C94.2 C95.2 C96.2 C97.2 C98.2 C99.2 C100.2 C101.2 C102.2 C103.2 C104.2 U2.A1(VSS) U2.A29(VSS) U2.AA3(VSS) U2.AA7(VSS) U2.AA23(VSS) U2.AA27(VSS) U2.AB8(VSS) U2.AB10(VSS) U2.AB12(VSS) U2.AB14(VSS) U2.AB16(VSS) U2.AB18(VSS) U2.AB20(VSS) U2.AB22(VSS) U2.AC3(VSS) U2.AC6(VSS) U2.AC24(VSS) U2.AC27(VSS) U2.AE3(VSS) U2.AE27(VSS) U2.AG4(VSS) U2.AG6(VSS) U2.AG8(VSS) U2.AG10(VSS) U2.AG12(VSS) U2.AG14(VSS) U2.AG16(VSS) U2.AG18(VSS) U2.AG20(VSS) U2.AG22(VSS) U2.AG24(VSS) U2.AG26(VSS) U2.AJ1(VSS) U2.AJ29(VSS) U2.C4(VSS) U2.C6(VSS) U2.C8(VSS) U2.C10(VSS) U2.C12(VSS) U2.C14(VSS) U2.C16(VSS) U2.C18(VSS) U2.C20(VSS) U2.C22(VSS) U2.C24(VSS) U2.C26(VSS) U2.E3(VSS) U2.E27(VSS) U2.G3(VSS) U2.G6(VSS) U2.G24(VSS) U2.G27(VSS) U2.H8(VSS) U2.H10(VSS) U2.H12(VSS) U2.H14(VSS) U2.H16(VSS) U2.H18(VSS) U2.H20(VSS) U2.H22(VSS) U2.J3(VSS) U2.J7(VSS) U2.J23(VSS) U2.J27(VSS) U2.L3(VSS) U2.L7(VSS) U2.L14(VSS) U2.L16(VSS) U2.L23(VSS) U2.L27(VSS) U2.M11(VSS) U2.M19(VSS) U2.N3(VSS) U2.N7(VSS) U2.N11(VSS) U2.N19(VSS) U2.N23(VSS) U2.N27(VSS) U2.P11(VSS) U2.P19(VSS) U2.R3(VSS) U2.R7(VSS) U2.R11(VSS) U2.R12(VSS) U2.R13(VSS) U2.R14(VSS) U2.R16(VSS) U2.R17(VSS) U2.R18(VSS) U2.R19(VSS) U2.R23(VSS) U2.R27(VSS) U2.T11(VSS) U2.T19(VSS) U2.U3(VSS) U2.U7(VSS) U2.U11(VSS) U2.U18(VSS) U2.U19(VSS) U2.U23(VSS) U2.U27(VSS) U2.V11(VSS) U2.V19(VSS) U2.W3(VSS) U2.W7(VSS) U2.W14(VSS) U2.W16(VSS) U2.W23(VSS) U2.W27(VSS)
VCC1.8_SNVS: C72.1 U2.R24(NVCC_SNVS_1P8)
VCC1.8_SYS: C34.1 C35.1 C36.1 C37.1 C38.1 C39.1 C68.1 U2.AA16(PVCC2_1P8) U2.AA19(PVCC1_1P8) U2.AA24(NVCC_ENET) U2.J11(NVCC_GPIO) U2.J16(PVCC0_1P8) U2.K11(NVCC_JTAG) U2.R22(NVCC_CLK) U2.U22(NVCC_NAND)
VCC3.3_SYS: C54.1 C55.1 C56.1 C57.1 U2.J14(VDD_USB_3P3) U2.U24(NVCC_SD1) U2.Y10(NVCC_I2C_UART)
VCC_ARM: C40.1 C41.1 C42.1 C43.1 C44.1 C49.1 C50.1 C51.1 C52.1 C53.1 NT1.2 U2.T14(VDD_ARM) U2.T16(VDD_ARM) U2.U12(VDD_ARM) U2.U13(VDD_ARM) U2.U14(VDD_ARM) U2.U15(VDD_ARM) U2.U16(VDD_ARM) U2.U17(VDD_ARM) U2.V14(VDD_ARM) U2.V16(VDD_ARM) U2.W12(VDD_ARM) U2.W13(VDD_ARM) U2.W17(VDD_ARM) U2.Y14(VDD_ARM) U2.Y15(VDD_ARM) U2.Y16(VDD_ARM)
VCC_SD2: C58.1 C59.1 U2.W24(NVCC_SD2)
VCC_SOC: C60.1 C61.1 C62.1 C63.1 C64.1 C65.1 C66.1 C67.1 C73.1 C74.1 C75.1 C76.1 C82.1 C83.1 C84.1 C85.1 C96.1 C97.1 C98.1 C99.1 NT2.2 U2.K10(VDD_SOC) U2.K14(VDD_USB_0P8) U2.K15(VDD_PCI_0P8) U2.K16(VDD_MIPI_0P8) U2.L9(VDD_SOC) U2.L10(VDD_SOC) U2.L11(VDD_SOC) U2.L12(VDD_SOC) U2.L13(VDD_SOC) U2.L17(VDD_SOC) U2.L18(VDD_SOC) U2.L19(VDD_SOC) U2.L20(VDD_SOC) U2.L21(VDD_SOC) U2.M14(VDD_SOC) U2.M16(VDD_SOC) U2.N9(VDD_SOC) U2.N10(VDD_SOC) U2.N12(VDD_SOC) U2.N13(VDD_SOC) U2.N14(VDD_SOC) U2.N15(VDD_SOC) U2.N16(VDD_SOC) U2.N17(VDD_SOC) U2.N18(VDD_SOC) U2.N20(VDD_SOC) U2.N21(VDD_SOC) U2.P14(VDD_SOC) U2.P16(VDD_SOC) U2.R9(VDD_DRAM_PLL_0P8) U2.R10(VDD_SOC) U2.R20(VDD_SOC) U2.R21(VDD_ANA1_0P8) U2.U9(VDD_SOC) U2.U10(VDD_SOC) U2.U20(VDD_SOC) U2.U21(VDD_SAI_PLL_0P8) U2.W9(VDD_SOC) U2.W10(VDD_SOC) U2.W11(VDD_SOC) U2.W20(VDD_SOC) U2.W21(VDD_ARM_PLL_0P8) U2.W22(VDD_HDMI_0P8)
VCCA1.8_SYS: C70.1 C77.1 C78.1 C79.1 C80.1 C81.1 C86.1 C87.1 C88.1 C89.1 C90.1 U2.AA20(VDD_EARC_1P8) U2.AA22(VDD_HDMI_1P8) U2.J19(VDD_USB_1P8) U2.J20(VDD_ANA0_1P8) U2.J22(VDD_LVDS_1P8) U2.K19(VDD_PCI_1P8) U2.K20(VDD_MIPI_1P8) U2.L22(VDD_24M_XTAL_1P8) U2.N22(VDD_ANA1_1P8) U2.R6(VDD_DRAM_PLL_1P8) U2.W18(VDD_SAI_PLL_1P8) U2.W19(VDD_AVPLL_1P8) U2.Y19(VDD_ARM_PLL_1P8) U2.Y20(VDD_ANA2_1P8)
GPIO_VREF: C45.1 C46.1 C47.1 C48.1 U2.AA11(NVCC_SAI2_SAI3_SPDIF) U2.AA14(NVCC_ECSPI_HDMI) U2.Y11(NVCC_SAI1_SAI5) ; port GPIO_VREF
R_SNSP1: NT2.1 ; port VCC_SOC_SENSE
R_SNSP2: NT1.1 ; port VCC_ARM_SENSE
VCC_MIPI_1P2_CAP: C69.1 U2.F20(VDD_MIPI_1P2_CAP)
VCC_SNVS_0P8_CAP: C71.1 U2.N26(VDD_SNVS_0P8_CAP)

### Layout directives
net class PWR: DRAM_VCC1.1, R_SNSP1, R_SNSP2, VCC1.8_SNVS, VCC1.8_SYS, VCC_ARM, VCC_MIPI_1P2_CAP, VCC_SNVS_0P8_CAP, VCC_SOC, VCCA1.8_SYS

### Notes on the sheet
- i.MX8MP Plus Power
- Place jumper close to SoC supply pins.
  Remote sense connection used to compensate
  for IR drop between regulator and load.
- 1.8V or 3.3V depending on VREF configuration
- i.MX8MP Ground
- 1.8V or 3.3V depending on SD2_VSEL
- Internal 0.8V regulator
- Internal 1.2V regulator
- Signal Level Indication
- Border Color = 1.8V
- Border Color = 3.3V
- Border Color = Don´t care
- OV Tech GmbH - Open Visions Technology
- (in symbol CAP_0201_1uF_6.3V) 0201; X5R
- (in symbol CAP_0402_10µ_6.3V) 0402; X5R
- (in symbol NetTie_0.2mm) NT
- (in symbol SoC_i.MX 8M Plus_Quad, part A) i.MX8MP - Power
- (in symbol SoC_i.MX 8M Plus_Quad, part B) i.MX8MP - Ground

### Library data of the parts
?#3 = Titleblock_01_OpenSource
C34-C38 C41-C47 C50-C56 C58 C61-C63 C65-C68 C70-C72 C74-C80 C83-C89 C92-C99 C101-C104 = CAP_0201_1uF_6.3V: as C24 on sheet 02_8MPLUS_PMIC; Manufacturer 2: Samsung Electro-Mechanics
C39 C40 C48 C49 C57 C59 C60 C64 C69 C73 C81 C82 C90 C91 C100 = CAP_0402_10µ_6.3V: Multilayer Ceramic Capacitors MLCC - SMD/SMT 0402 6.3VDC; Manufacturer 1: KYOCERA AVX; Manufacturer 1 Prt. Nr.: KGM05CS60J106MH; Manufacturer 2 Prt. Nr.: GRT155C80J106ME13J; Manufacturer 2: Murata
NT1 NT2 = NetTie_0.2mm: Net Tie Element
U2 = SoC_i.MX 8M Plus_Quad: i.MX 8M Plus Applications Processor  for Industrial Products; Manufacturer 1: NXP Semiconductor; Manufacturer 1 Prt. Nr.: MIMX8ML8CVNKZAB

## Sheet 04_8MPLUS_DRAM.SchDoc: 8MPLUS_DRAM
size 420 x 297 mm; Author: Lukas Henkel; DocumentNumber: 4; SheetNumber: 4; SheetTotal: 16; DocSize: A3
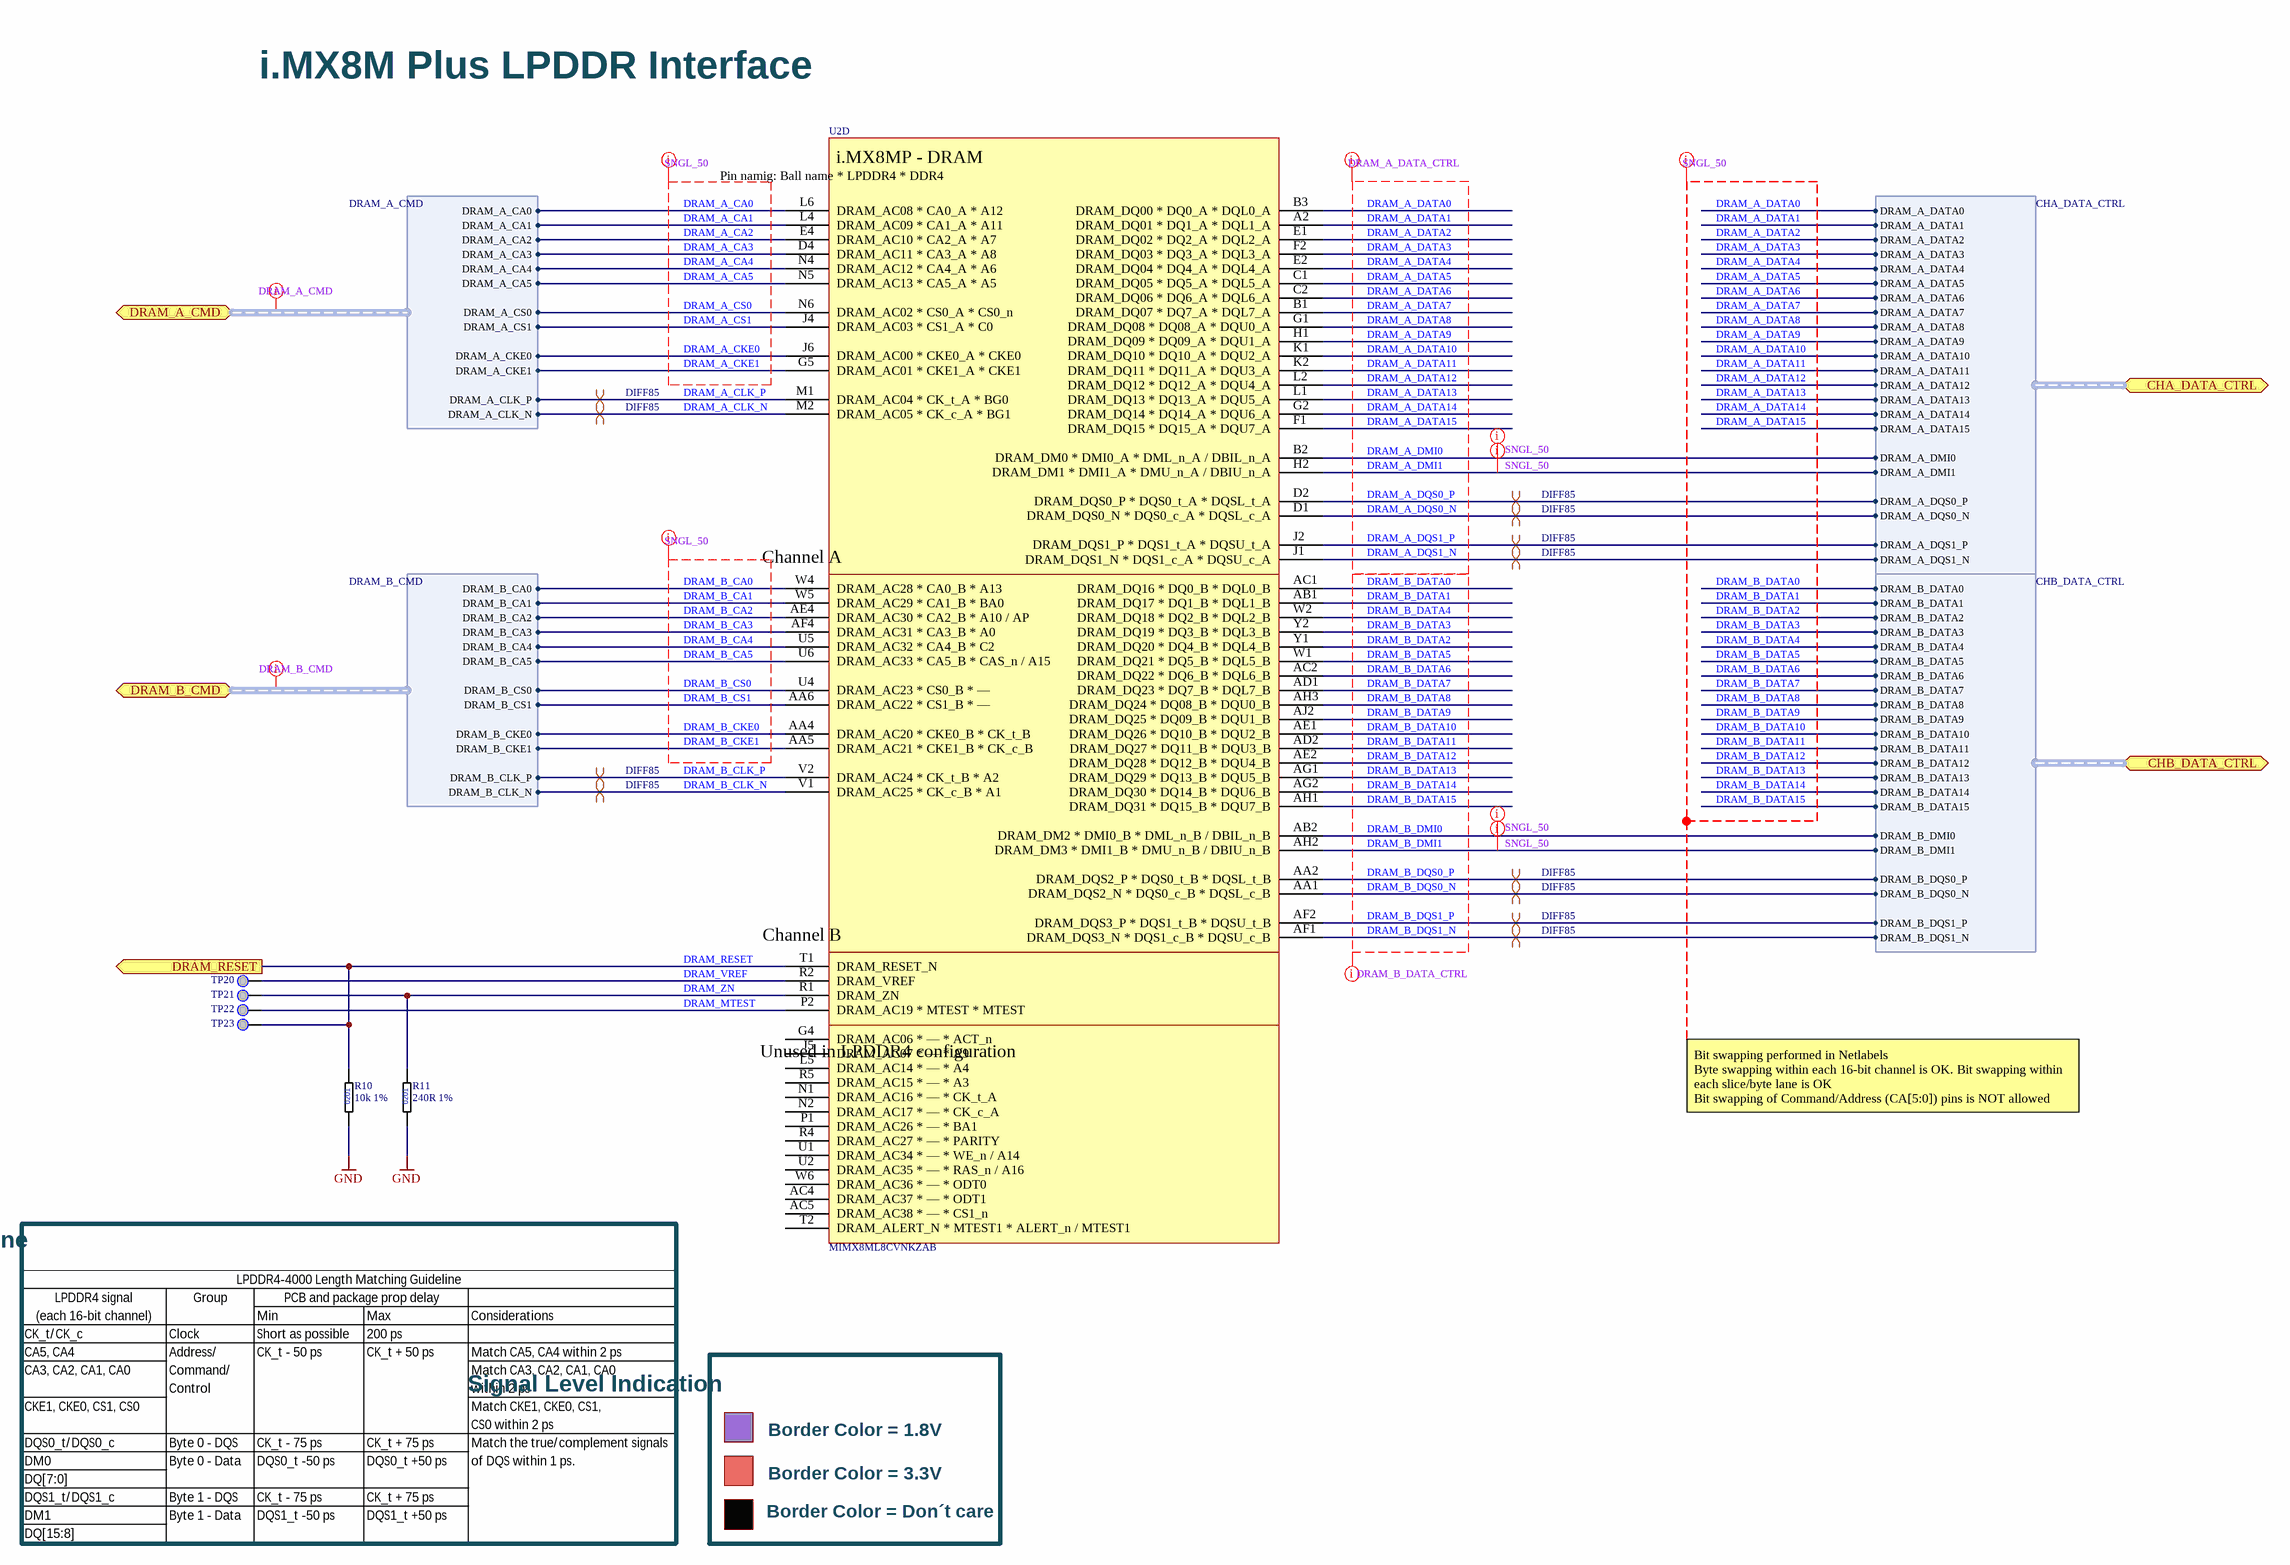
[diagram p4: 04_8MPLUS_DRAM.SchDoc]

### Parts
(Parts that share a designator on the sheet are numbered #1, #2 ... from top to bottom, then left to right.)
?#4  (no value)  (graphical)
R10  10k 1%  [RESC0603X03L]
R11  240R 1%  [RESC0603X03L]
TP20  Testpoint 0.5mm  [TP_0.50mm]  (value not drawn)  (no BOM)
TP21  Testpoint 0.5mm  [TP_0.50mm]  (value not drawn)  (no BOM)
TP22  Testpoint 0.5mm  [TP_0.50mm]  (value not drawn)  (no BOM)
TP23  Testpoint 0.5mm  [TP_0.50mm]  (value not drawn)  (no BOM)
U2  MIMX8ML8CVNKZAB  [BGA548C50P29X29_1500X1500X148]  (part D of 15)

### Ports
CHA_DATA_CTRL (bidir, harness CHA_DATA_CTRL), CHB_DATA_CTRL (bidir, harness CHB_DATA_CTRL), DRAM_A_CMD (bidir, harness DRAM_A_CMD), DRAM_B_CMD (bidir, harness DRAM_B_CMD), DRAM_RESET (out)

### Harnesses
CHA_DATA_CTRL: DRAM_A_DATA0, DRAM_A_DATA1, DRAM_A_DATA2, DRAM_A_DATA3, DRAM_A_DATA4, DRAM_A_DATA5, DRAM_A_DATA6, DRAM_A_DATA7, DRAM_A_DATA8, DRAM_A_DATA9, DRAM_A_DATA10, DRAM_A_DATA11, DRAM_A_DATA12, DRAM_A_DATA13, DRAM_A_DATA14, DRAM_A_DATA15, DRAM_A_DMI0, DRAM_A_DMI1, DRAM_A_DQS0_P, DRAM_A_DQS0_N, DRAM_A_DQS1_P, DRAM_A_DQS1_N
CHB_DATA_CTRL: DRAM_B_DATA0, DRAM_B_DATA1, DRAM_B_DATA2, DRAM_B_DATA3, DRAM_B_DATA4, DRAM_B_DATA5, DRAM_B_DATA6, DRAM_B_DATA7, DRAM_B_DATA8, DRAM_B_DATA9, DRAM_B_DATA10, DRAM_B_DATA11, DRAM_B_DATA12, DRAM_B_DATA13, DRAM_B_DATA14, DRAM_B_DATA15, DRAM_B_DMI0, DRAM_B_DMI1, DRAM_B_DQS0_P, DRAM_B_DQS0_N, DRAM_B_DQS1_P, DRAM_B_DQS1_N
DRAM_A_CMD: DRAM_A_CA0, DRAM_A_CA1, DRAM_A_CA2, DRAM_A_CA3, DRAM_A_CA4, DRAM_A_CA5, DRAM_A_CS0, DRAM_A_CS1, DRAM_A_CKE0, DRAM_A_CKE1, DRAM_A_CLK_P, DRAM_A_CLK_N
DRAM_B_CMD: DRAM_B_CA0, DRAM_B_CA1, DRAM_B_CA2, DRAM_B_CA3, DRAM_B_CA4, DRAM_B_CA5, DRAM_B_CS0, DRAM_B_CS1, DRAM_B_CKE0, DRAM_B_CKE1, DRAM_B_CLK_P, DRAM_B_CLK_N

### Nets
GND: R10.1 R11.1
DRAM_A_CA0: U2.L6(DRAM_AC08_*_CA0_A_*_A12) ; port DRAM_A_CMD.DRAM_A_CA0
DRAM_A_CA1: U2.L4(DRAM_AC09_*_CA1_A_*_A11) ; port DRAM_A_CMD.DRAM_A_CA1
DRAM_A_CA2: U2.E4(DRAM_AC10_*_CA2_A_*_A7) ; port DRAM_A_CMD.DRAM_A_CA2
DRAM_A_CA3: U2.D4(DRAM_AC11_*_CA3_A_*_A8) ; port DRAM_A_CMD.DRAM_A_CA3
DRAM_A_CA4: U2.N4(DRAM_AC12_*_CA4_A_*_A6) ; port DRAM_A_CMD.DRAM_A_CA4
DRAM_A_CA5: U2.N5(DRAM_AC13_*_CA5_A_*_A5) ; port DRAM_A_CMD.DRAM_A_CA5
DRAM_A_CKE0: U2.J6(DRAM_AC00_*_CKE0_A_*_CKE0) ; port DRAM_A_CMD.DRAM_A_CKE0
DRAM_A_CKE1: U2.G5(DRAM_AC01_*_CKE1_A_*_CKE1) ; port DRAM_A_CMD.DRAM_A_CKE1
DRAM_A_CLK_N: U2.M2(DRAM_AC05_*_CK_c_A_*_BG1) ; port DRAM_A_CMD.DRAM_A_CLK_N
DRAM_A_CLK_P: U2.M1(DRAM_AC04_*_CK_t_A_*_BG0) ; port DRAM_A_CMD.DRAM_A_CLK_P
DRAM_A_CS0: U2.N6(DRAM_AC02_*_CS0_A_*_CS0_n) ; port DRAM_A_CMD.DRAM_A_CS0
DRAM_A_CS1: U2.J4(DRAM_AC03_*_CS1_A_*_C0) ; port DRAM_A_CMD.DRAM_A_CS1
DRAM_A_DATA0: U2.B3(DRAM_DQ00_*_DQ0_A_*_DQL0_A) ; port CHA_DATA_CTRL.DRAM_A_DATA0
DRAM_A_DATA1: U2.A2(DRAM_DQ01_*_DQ1_A_*_DQL1_A) ; port CHA_DATA_CTRL.DRAM_A_DATA1
DRAM_A_DATA2: U2.E1(DRAM_DQ02_*_DQ2_A_*_DQL2_A) ; port CHA_DATA_CTRL.DRAM_A_DATA2
DRAM_A_DATA3: U2.F2(DRAM_DQ03_*_DQ3_A_*_DQL3_A) ; port CHA_DATA_CTRL.DRAM_A_DATA3
DRAM_A_DATA4: U2.E2(DRAM_DQ04_*_DQ4_A_*_DQL4_A) ; port CHA_DATA_CTRL.DRAM_A_DATA4
DRAM_A_DATA5: U2.C1(DRAM_DQ05_*_DQ5_A_*_DQL5_A) ; port CHA_DATA_CTRL.DRAM_A_DATA5
DRAM_A_DATA6: U2.C2(DRAM_DQ06_*_DQ6_A_*_DQL6_A) ; port CHA_DATA_CTRL.DRAM_A_DATA6
DRAM_A_DATA7: U2.B1(DRAM_DQ07_*_DQ7_A_*_DQL7_A) ; port CHA_DATA_CTRL.DRAM_A_DATA7
DRAM_A_DATA8: U2.G1(DRAM_DQ08_*_DQ08_A_*_DQU0_A) ; port CHA_DATA_CTRL.DRAM_A_DATA8
DRAM_A_DATA9: U2.H1(DRAM_DQ09_*_DQ09_A_*_DQU1_A) ; port CHA_DATA_CTRL.DRAM_A_DATA9
DRAM_A_DATA10: U2.K1(DRAM_DQ10_*_DQ10_A_*_DQU2_A) ; port CHA_DATA_CTRL.DRAM_A_DATA10
DRAM_A_DATA11: U2.K2(DRAM_DQ11_*_DQ11_A_*_DQU3_A) ; port CHA_DATA_CTRL.DRAM_A_DATA11
DRAM_A_DATA12: U2.L2(DRAM_DQ12_*_DQ12_A_*_DQU4_A) ; port CHA_DATA_CTRL.DRAM_A_DATA12
DRAM_A_DATA13: U2.L1(DRAM_DQ13_*_DQ13_A_*_DQU5_A) ; port CHA_DATA_CTRL.DRAM_A_DATA13
DRAM_A_DATA14: U2.G2(DRAM_DQ14_*_DQ14_A_*_DQU6_A) ; port CHA_DATA_CTRL.DRAM_A_DATA14
DRAM_A_DATA15: U2.F1(DRAM_DQ15_*_DQ15_A_*_DQU7_A) ; port CHA_DATA_CTRL.DRAM_A_DATA15
DRAM_A_DMI0: U2.B2(DRAM_DM0_*_DMI0_A_*_DML_n_A_/_DBIL_n_A) ; port CHA_DATA_CTRL.DRAM_A_DMI0
DRAM_A_DMI1: U2.H2(DRAM_DM1_*_DMI1_A_*_DMU_n_A_/_DBIU_n_A) ; port CHA_DATA_CTRL.DRAM_A_DMI1
DRAM_A_DQS0_N: U2.D1(DRAM_DQS0_N_*_DQS0_c_A_*_DQSL_c_A) ; port CHA_DATA_CTRL.DRAM_A_DQS0_N
DRAM_A_DQS0_P: U2.D2(DRAM_DQS0_P_*_DQS0_t_A_*_DQSL_t_A) ; port CHA_DATA_CTRL.DRAM_A_DQS0_P
DRAM_A_DQS1_N: U2.J1(DRAM_DQS1_N_*_DQS1_c_A_*_DQSU_c_A) ; port CHA_DATA_CTRL.DRAM_A_DQS1_N
DRAM_A_DQS1_P: U2.J2(DRAM_DQS1_P_*_DQS1_t_A_*_DQSU_t_A) ; port CHA_DATA_CTRL.DRAM_A_DQS1_P
DRAM_B_CA0: U2.W4(DRAM_AC28_*_CA0_B_*_A13) ; port DRAM_B_CMD.DRAM_B_CA0
DRAM_B_CA1: U2.W5(DRAM_AC29_*_CA1_B_*_BA0) ; port DRAM_B_CMD.DRAM_B_CA1
DRAM_B_CA2: U2.AE4(DRAM_AC30_*_CA2_B_*_A10_/_AP) ; port DRAM_B_CMD.DRAM_B_CA2
DRAM_B_CA3: U2.AF4(DRAM_AC31_*_CA3_B_*_A0) ; port DRAM_B_CMD.DRAM_B_CA3
DRAM_B_CA4: U2.U5(DRAM_AC32_*_CA4_B_*_C2) ; port DRAM_B_CMD.DRAM_B_CA4
DRAM_B_CA5: U2.U6(DRAM_AC33_*_CA5_B_*_CAS_n_/_A15) ; port DRAM_B_CMD.DRAM_B_CA5
DRAM_B_CKE0: U2.AA4(DRAM_AC20_*_CKE0_B_*_CK_t_B) ; port DRAM_B_CMD.DRAM_B_CKE0
DRAM_B_CKE1: U2.AA5(DRAM_AC21_*_CKE1_B_*_CK_c_B) ; port DRAM_B_CMD.DRAM_B_CKE1
DRAM_B_CLK_N: U2.V1(DRAM_AC25_*_CK_c_B_*_A1) ; port DRAM_B_CMD.DRAM_B_CLK_N
DRAM_B_CLK_P: U2.V2(DRAM_AC24_*_CK_t_B_*_A2) ; port DRAM_B_CMD.DRAM_B_CLK_P
DRAM_B_CS0: U2.U4(DRAM_AC23_*_CS0_B_*_—) ; port DRAM_B_CMD.DRAM_B_CS0
DRAM_B_CS1: U2.AA6(DRAM_AC22_*_CS1_B_*_—) ; port DRAM_B_CMD.DRAM_B_CS1
DRAM_B_DATA0: U2.AC1(DRAM_DQ16_*_DQ0_B_*_DQL0_B) ; port CHB_DATA_CTRL.DRAM_B_DATA0
DRAM_B_DATA1: U2.AB1(DRAM_DQ17_*_DQ1_B_*_DQL1_B) ; port CHB_DATA_CTRL.DRAM_B_DATA1
DRAM_B_DATA2: U2.Y1(DRAM_DQ20_*_DQ4_B_*_DQL4_B) ; port CHB_DATA_CTRL.DRAM_B_DATA2
DRAM_B_DATA3: U2.Y2(DRAM_DQ19_*_DQ3_B_*_DQL3_B) ; port CHB_DATA_CTRL.DRAM_B_DATA3
DRAM_B_DATA4: U2.W2(DRAM_DQ18_*_DQ2_B_*_DQL2_B) ; port CHB_DATA_CTRL.DRAM_B_DATA4
DRAM_B_DATA5: U2.W1(DRAM_DQ21_*_DQ5_B_*_DQL5_B) ; port CHB_DATA_CTRL.DRAM_B_DATA5
DRAM_B_DATA6: U2.AC2(DRAM_DQ22_*_DQ6_B_*_DQL6_B) ; port CHB_DATA_CTRL.DRAM_B_DATA6
DRAM_B_DATA7: U2.AD1(DRAM_DQ23_*_DQ7_B_*_DQL7_B) ; port CHB_DATA_CTRL.DRAM_B_DATA7
DRAM_B_DATA8: U2.AH3(DRAM_DQ24_*_DQ08_B_*_DQU0_B) ; port CHB_DATA_CTRL.DRAM_B_DATA8
DRAM_B_DATA9: U2.AJ2(DRAM_DQ25_*_DQ09_B_*_DQU1_B) ; port CHB_DATA_CTRL.DRAM_B_DATA9
DRAM_B_DATA10: U2.AE1(DRAM_DQ26_*_DQ10_B_*_DQU2_B) ; port CHB_DATA_CTRL.DRAM_B_DATA10
DRAM_B_DATA11: U2.AD2(DRAM_DQ27_*_DQ11_B_*_DQU3_B) ; port CHB_DATA_CTRL.DRAM_B_DATA11
DRAM_B_DATA12: U2.AE2(DRAM_DQ28_*_DQ12_B_*_DQU4_B) ; port CHB_DATA_CTRL.DRAM_B_DATA12
DRAM_B_DATA13: U2.AG1(DRAM_DQ29_*_DQ13_B_*_DQU5_B) ; port CHB_DATA_CTRL.DRAM_B_DATA13
DRAM_B_DATA14: U2.AG2(DRAM_DQ30_*_DQ14_B_*_DQU6_B) ; port CHB_DATA_CTRL.DRAM_B_DATA14
DRAM_B_DATA15: U2.AH1(DRAM_DQ31_*_DQ15_B_*_DQU7_B) ; port CHB_DATA_CTRL.DRAM_B_DATA15
DRAM_B_DMI0: U2.AB2(DRAM_DM2_*_DMI0_B_*_DML_n_B_/_DBIL_n_B) ; port CHB_DATA_CTRL.DRAM_B_DMI0
DRAM_B_DMI1: U2.AH2(DRAM_DM3_*_DMI1_B_*_DMU_n_B_/_DBIU_n_B) ; port CHB_DATA_CTRL.DRAM_B_DMI1
DRAM_B_DQS0_N: U2.AA1(DRAM_DQS2_N_*_DQS0_c_B_*_DQSL_c_B) ; port CHB_DATA_CTRL.DRAM_B_DQS0_N
DRAM_B_DQS0_P: U2.AA2(DRAM_DQS2_P_*_DQS0_t_B_*_DQSL_t_B) ; port CHB_DATA_CTRL.DRAM_B_DQS0_P
DRAM_B_DQS1_N: U2.AF1(DRAM_DQS3_N_*_DQS1_c_B_*_DQSU_c_B) ; port CHB_DATA_CTRL.DRAM_B_DQS1_N
DRAM_B_DQS1_P: U2.AF2(DRAM_DQS3_P_*_DQS1_t_B_*_DQSU_t_B) ; port CHB_DATA_CTRL.DRAM_B_DQS1_P
DRAM_MTEST: TP22.TP U2.P2(DRAM_AC19_*_MTEST_*_MTEST)
DRAM_RESET: R10.2 TP23.TP U2.T1(DRAM_RESET_N) ; port DRAM_RESET
DRAM_VREF: TP20.TP U2.R2(DRAM_VREF)
DRAM_ZN: R11.2 TP21.TP U2.R1(DRAM_ZN)

Not connected (* = marked no-connect by the designer): U2 AC4(DRAM_AC37_*_—_*_ODT1) AC5(DRAM_AC38_*_—_*_CS1_n) G4(DRAM_AC06_*_—_*_ACT_n) J5(DRAM_AC07_*_—_*_A9) L5(DRAM_AC14_*_—_*_A4) N1(DRAM_AC16_*_—_*_CK_t_A) N2(DRAM_AC17_*_—_*_CK_c_A) P1(DRAM_AC26_*_—_*_BA1) R4(DRAM_AC27_*_—_*_PARITY) R5(DRAM_AC15_*_—_*_A3) T2(DRAM_ALERT_N_*_MTEST1_*_ALERT_n_/_MTEST1) U1(DRAM_AC34_*_—_*_WE_n_/_A14) U2(DRAM_AC35_*_—_*_RAS_n_/_A16) W6(DRAM_AC36_*_—_*_ODT0)

### Layout directives
differential pair; differential pair class DIFF85: DRAM_A_CLK_N, DRAM_A_CLK_P, DRAM_A_DQS0_N, DRAM_A_DQS0_P, DRAM_A_DQS1_N, DRAM_A_DQS1_P, DRAM_B_CLK_N, DRAM_B_CLK_P, DRAM_B_DQS0_N, DRAM_B_DQS0_P, DRAM_B_DQS1_N, DRAM_B_DQS1_P
net class DRAM_A_DATA_CTRL: DRAM_A_DATA0, DRAM_A_DATA1, DRAM_A_DATA2, DRAM_A_DATA3, DRAM_A_DATA4, DRAM_A_DATA5, DRAM_A_DATA6, DRAM_A_DATA7, DRAM_A_DATA8, DRAM_A_DATA9, DRAM_A_DATA10, DRAM_A_DATA11, DRAM_A_DATA12, DRAM_A_DATA13, DRAM_A_DATA14, DRAM_A_DATA15, DRAM_A_DMI0, DRAM_A_DMI1, DRAM_A_DQS0_N, DRAM_A_DQS0_P, DRAM_A_DQS1_N, DRAM_A_DQS1_P
net class DRAM_B_DATA_CTRL: DRAM_B_DATA0, DRAM_B_DATA1, DRAM_B_DATA2, DRAM_B_DATA3, DRAM_B_DATA4, DRAM_B_DATA5, DRAM_B_DATA6, DRAM_B_DATA7, DRAM_B_DATA8, DRAM_B_DATA9, DRAM_B_DATA10, DRAM_B_DATA11, DRAM_B_DATA12, DRAM_B_DATA13, DRAM_B_DATA14, DRAM_B_DATA15, DRAM_B_DMI0, DRAM_B_DMI1, DRAM_B_DQS0_N, DRAM_B_DQS0_P, DRAM_B_DQS1_N, DRAM_B_DQS1_P
net class DRAM_B_CMD: (no net found under the mark)
net class DRAM_A_CMD: (no net found under the mark)
net class SNGL_50: DRAM_A_CA0, DRAM_A_CA1, DRAM_A_CA2, DRAM_A_CA3, DRAM_A_CA4, DRAM_A_CA5, DRAM_A_CKE0, DRAM_A_CKE1, DRAM_A_CS0, DRAM_A_CS1, DRAM_A_DATA0, DRAM_A_DATA1, DRAM_A_DATA2, DRAM_A_DATA3, DRAM_A_DATA4, DRAM_A_DATA5, DRAM_A_DATA6, DRAM_A_DATA7, DRAM_A_DATA8, DRAM_A_DATA9, DRAM_A_DATA10, DRAM_A_DATA11, DRAM_A_DATA12, DRAM_A_DATA13, DRAM_A_DATA14, DRAM_A_DATA15, DRAM_A_DMI0, DRAM_A_DMI1, DRAM_B_CA0, DRAM_B_CA1, DRAM_B_CA2, DRAM_B_CA3, DRAM_B_CA4, DRAM_B_CA5, DRAM_B_CKE0, DRAM_B_CKE1, DRAM_B_CS0, DRAM_B_CS1, DRAM_B_DATA0, DRAM_B_DATA1, DRAM_B_DATA2, DRAM_B_DATA3, DRAM_B_DATA4, DRAM_B_DATA5, DRAM_B_DATA6, DRAM_B_DATA7, DRAM_B_DATA8, DRAM_B_DATA9, DRAM_B_DATA10, DRAM_B_DATA11, DRAM_B_DATA12, DRAM_B_DATA13, DRAM_B_DATA14, DRAM_B_DATA15, DRAM_B_DMI0, DRAM_B_DMI1

### Notes on the sheet
- i.MX8M Plus LPDDR Interface
- Bit swapping performed in Netlabels
  Byte swapping within each 16-bit channel is OK. Bit swapping within each slice/byte lane is OK
  Bit swapping of Command/Address (CA[5:0]) pins is NOT allowed
- PCB Layout Length Matching Guideline
- Signal Level Indication
- Border Color = 1.8V
- Border Color = Don´t care
- Border Color = 3.3V
- OV Tech GmbH - Open Visions Technology
- (in symbol RES_0201_10k_1%) 0201
- (in symbol RES_0201_240R_1%) 0201
- (in symbol SoC_i.MX 8M Plus_Quad, part D) i.MX8MP - DRAM; Pin namig: Ball name * LPDDR4 * DDR4; Channel A; Channel B; Unused in LPDDR4 configuration

### Library data of the parts
?#4 = Titleblock_01_OpenSource
R10 = RES_0201_10k_1%: Thick Film Resistors - SMD 10K OHM 1%; Manufacturer 1: Yageo; Manufacturer 1 Prt. Nr.: RC0201FR-0710KL; Manufacturer 2 Prt. Nr.: CRCW020110K0FNED; Manufacturer 2: Vishay / Dale
R11 = RES_0201_240R_1%: Thick Film Resistors - SMD 240 OHM 1%; Manufacturer 1: Yageo; Manufacturer 1 Prt. Nr.: RC0201FR-07240RL; Manufacturer 2 Prt. Nr.: CRCW0201240RFNED; Manufacturer 2: Vishay / Dale
U2 = SoC_i.MX 8M Plus_Quad: as U2 on sheet 03_8MPLUS_PWR; Manufacturer 1 Prt. Nr.: MIMX8ML8CVNKZAB

## Sheet 05_8MPLUS_CFG.SchDoc: 8MPLUS_CFG
size 420 x 297 mm; Author: Lukas Henkel; DocumentNumber: 5; SheetNumber: 5; SheetTotal: 16; DocSize: A3
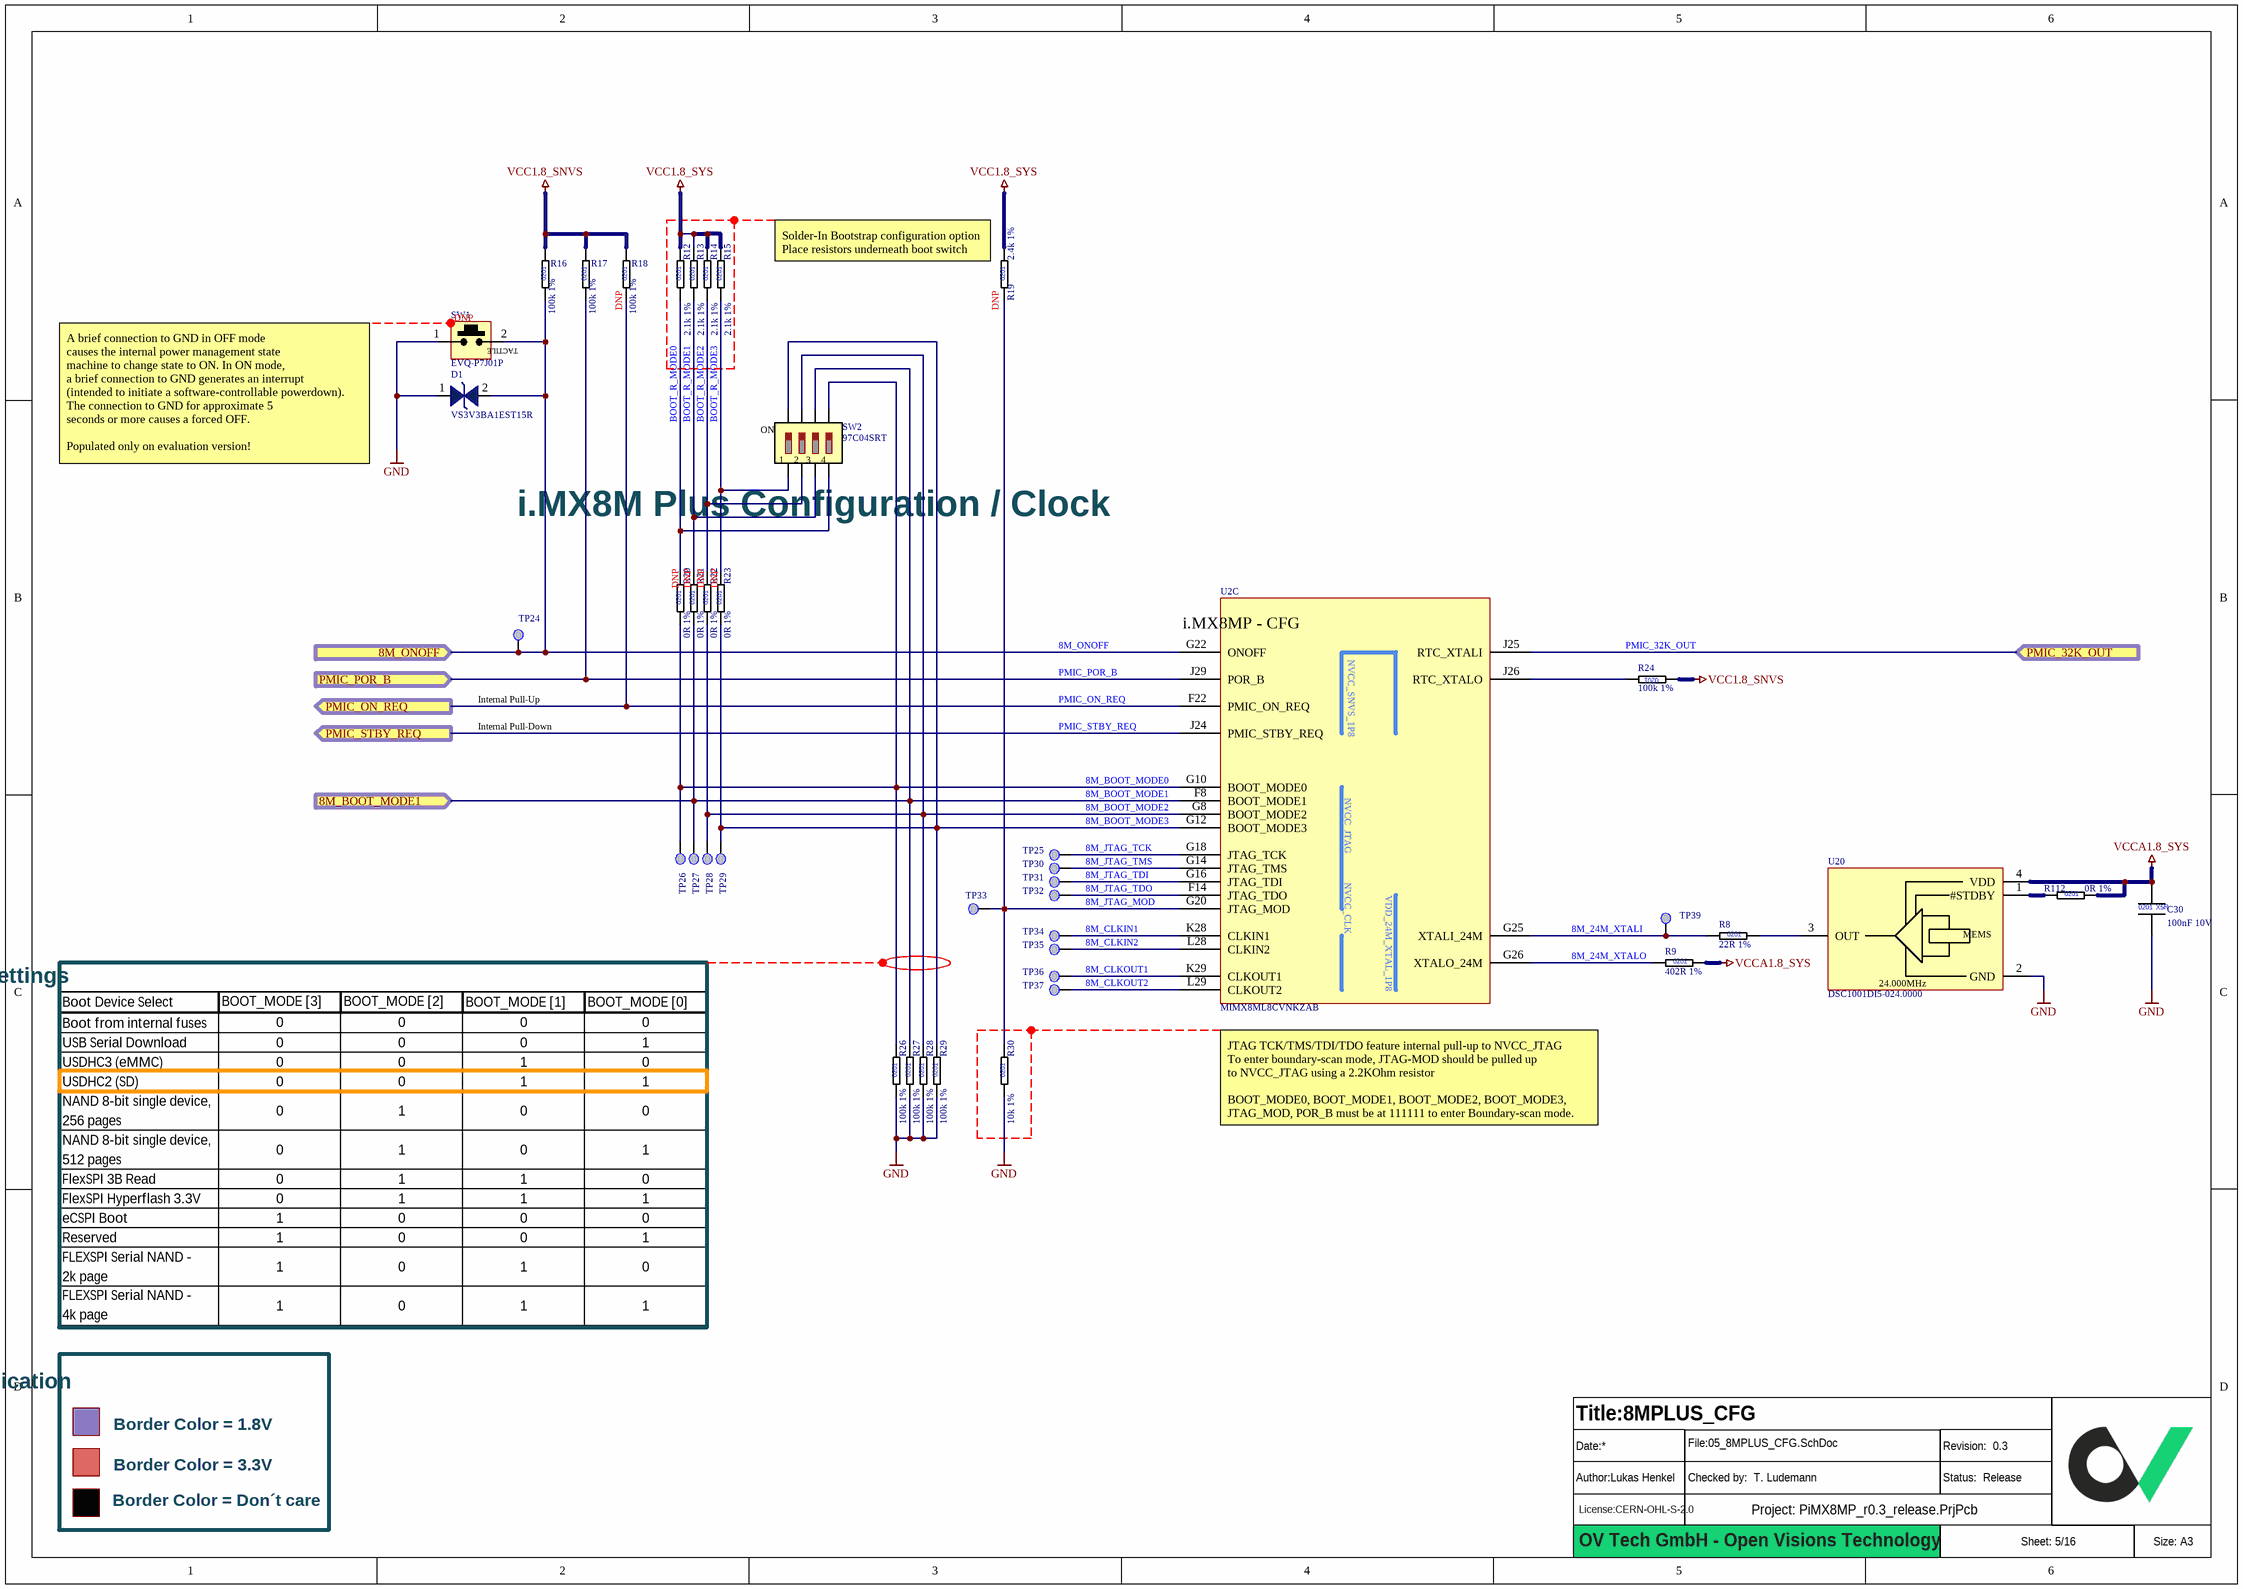
[diagram p5: 05_8MPLUS_CFG.SchDoc]

### Parts
(Parts that share a designator on the sheet are numbered #1, #2 ... from top to bottom, then left to right.)
?#5  (no value)  (graphical)
C30  100nF 10V  [CAPC0603X03L]
D1  VS3V3BA1EST15R  [DFN38P60X29-2L]
R8  22R 1%  [RESC0603X03L]
R9  402R 1%  [RESC0603X03L]
R12  2.1k 1%  [RESC0603X03L]
R13  2.1k 1%  [RESC0603X03L]
R14  2.1k 1%  [RESC0603X03L]
R15  2.1k 1%  [RESC0603X03L]
R16  100k 1%  [RESC0603X03L]
R17  100k 1%  [RESC0603X03L]
R18  100k 1%  [RESC0603X03L]
R19  2.4k 1%  [RESC0603X03L]  (no BOM)
R20  0R 1%  [RESC0603X03L]
R21  0R 1%  [RESC0603X03L]
R22  0R 1%  [RESC0603X03L]
R23  0R 1%  [RESC0603X03L]
R24  100k 1%  [RESC0603X03L]
R26  100k 1%  [RESC0603X03L]
R27  100k 1%  [RESC0603X03L]
R28  100k 1%  [RESC0603X03L]
R29  100k 1%  [RESC0603X03L]
R30  10k 1%  [RESC0603X03L]
R112  0R 1%  [RESC0603X03L]
SW1  EVQ-P7J01P  [SW_TACT_EVQ-P7J01P]
SW2  97C04SRT  [SW_DIP_4POL_97C04SRT]
TP24  Testpoint 0.5mm  [TP_0.50mm]  (value not drawn)  (no BOM)
TP25  Testpoint 0.5mm  [TP_0.50mm]  (value not drawn)  (no BOM)
TP26  Testpoint 0.5mm  [TP_0.50mm]  (value not drawn)  (no BOM)
TP27  Testpoint 0.5mm  [TP_0.50mm]  (value not drawn)  (no BOM)
TP28  Testpoint 0.5mm  [TP_0.50mm]  (value not drawn)  (no BOM)
TP29  Testpoint 0.5mm  [TP_0.50mm]  (value not drawn)  (no BOM)
TP30  Testpoint 0.5mm  [TP_0.50mm]  (value not drawn)  (no BOM)
TP31  Testpoint 0.5mm  [TP_0.50mm]  (value not drawn)  (no BOM)
TP32  Testpoint 0.5mm  [TP_0.50mm]  (value not drawn)  (no BOM)
TP33  Testpoint 0.5mm  [TP_0.50mm]  (value not drawn)  (no BOM)
TP34  Testpoint 0.5mm  [TP_0.50mm]  (value not drawn)  (no BOM)
TP35  Testpoint 0.5mm  [TP_0.50mm]  (value not drawn)  (no BOM)
TP36  Testpoint 0.5mm  [TP_0.50mm]  (value not drawn)  (no BOM)
TP37  Testpoint 0.5mm  [TP_0.50mm]  (value not drawn)  (no BOM)
TP39  Testpoint 0.5mm  [TP_0.50mm]  (value not drawn)  (no BOM)
U2  MIMX8ML8CVNKZAB  [BGA548C50P29X29_1500X1500X148]  (part C of 15)
U20  DSC1001DI5-024.0000  [DFN165P250X90-4N]

### Ports
8M_BOOT_MODE1 (in), 8M_ONOFF (in), PMIC_32K_OUT (in), PMIC_ON_REQ (out), PMIC_POR_B (in), PMIC_STBY_REQ (out)

### Nets
GND: C30.2 D1.1 R26.1 R27.1 R28.1 R29.1 R30.1 SW1.1 U20.2(GND)
VCC1.8_SNVS: R16.2 R17.2 R18.2 R24.1
VCC1.8_SYS: R12.2 R13.2 R14.2 R15.2 R19.2
VCCA1.8_SYS: C30.1 R9.2 R112.2 U20.4(VDD)
8M_24M_XTALI: R8.1 TP39.TP U2.G25(XTALI_24M)
8M_24M_XTALO: R9.1 U2.G26(XTALO_24M)
8M_BOOT_MODE0: R20.1 R26.2 SW2.5 TP26.TP U2.G10(BOOT_MODE0)
8M_BOOT_MODE1: R21.1 R27.2 SW2.6 TP27.TP U2.F8(BOOT_MODE1) ; port 8M_BOOT_MODE1
8M_BOOT_MODE2: R22.1 R28.2 SW2.7 TP28.TP U2.G8(BOOT_MODE2)
8M_BOOT_MODE3: R23.1 R29.2 SW2.8 TP29.TP U2.G12(BOOT_MODE3)
8M_CLKIN1: TP34.TP U2.K28(CLKIN1)
8M_CLKIN2: TP35.TP U2.L28(CLKIN2)
8M_CLKOUT1: TP36.TP U2.K29(CLKOUT1)
8M_CLKOUT2: TP37.TP U2.L29(CLKOUT2)
8M_JTAG_MOD: R19.1 R30.2 TP33.TP U2.G20(JTAG_MOD)
8M_JTAG_TCK: TP25.TP U2.G18(JTAG_TCK)
8M_JTAG_TDI: TP31.TP U2.G16(JTAG_TDI)
8M_JTAG_TDO: TP32.TP U2.F14(JTAG_TDO)
8M_JTAG_TMS: TP30.TP U2.G14(JTAG_TMS)
8M_ONOFF: D1.2 R16.1 SW1.2 TP24.TP U2.G22(ONOFF) ; port 8M_ONOFF
BOOT_R_MODE0: R12.1 R20.2 SW2.4
BOOT_R_MODE1: R13.1 R21.2 SW2.3
BOOT_R_MODE2: R14.1 R22.2 SW2.2
BOOT_R_MODE3: R15.1 R23.2 SW2.1
PMIC_32K_OUT: U2.J25(RTC_XTALI) ; port PMIC_32K_OUT
PMIC_ON_REQ: R18.1 U2.F22(PMIC_ON_REQ) ; port PMIC_ON_REQ
PMIC_POR_B: R17.1 U2.J29(POR_B) ; port PMIC_POR_B
PMIC_STBY_REQ: U2.J24(PMIC_STBY_REQ) ; port PMIC_STBY_REQ
NetR8_2: R8.2 U20.3(OUT)
NetR24_2: R24.2 U2.J26(RTC_XTALO)
NetR112_1: R112.1 U20.1(#STDBY)

### Notes on the sheet
- (near R19) Solder-In Bootstrap configuration option
  Place resistors underneath boot switch
- (near SW1) DNP
- (near R18) DNP
- (near R19) DNP
- A brief connection to GND in OFF mode
  causes the internal power management state
  machine to change state to ON. In ON mode,
  a brief connection to GND generates an interrupt
  (intended to initiate a software-controllable powerdown).
  The connection to GND for approximate 5
  seconds or more causes a forced OFF.
  Populated only on evaluation version!
- i.MX8M Plus Configuration / Clock
- DNP
- Internal Pull-Up
- Internal Pull-Down
- Boot Mode Pin Settings
- (near U2) JTAG TCK/TMS/TDI/TDO feature internal pull-up to NVCC_JTAG
  To enter boundary-scan mode, JTAG-MOD should be pulled up
  to NVCC_JTAG using a 2.2KOhm resistor
  BOOT_MODE0, BOOT_MODE1, BOOT_MODE2, BOOT_MODE3,
  JTAG_MOD, POR_B must be at 111111 to enter Boundary-scan mode.
- Signal Level Indication
- Border Color = 1.8V
- Border Color = 3.3V
- Border Color = Don´t care
- OV Tech GmbH - Open Visions Technology
- (in symbol CAP_0201_100nF_10V) 0201; X5R
- (in symbol MEMS Oscillator_Microchip_DSC1001DI5-024.0000) MEMS; 24.000MHz
- (in symbol RES_0201_0R_1%) 0201
- (in symbol RES_0201_2.1k_1%) 0201
- (in symbol RES_0201_2.4k_1%) 0201
- (in symbol RES_0201_10k_1%) 0201
- (in symbol RES_0201_22R_1%) 0201
- (in symbol RES_0201_100k_1%) 0201
- (in symbol RES_0201_402R_1%) 0201
- (in symbol SoC_i.MX 8M Plus_Quad, part C) i.MX8MP - CFG
- (in symbol SW_DIP_97C04SRT) ON
- (in symbol SW_TACTILE_EVQ-P7J01P) TACTILE

### Library data of the parts
?#5 = Titleblock_01_OpenSource
C30 = CAP_0201_100nF_10V: as C27 on sheet 02_8MPLUS_PMIC; Manufacturer 2: Samsung Electro-Mechanics
D1 = ESD Protection Diode_3.3V_VS3V3BA1EST15R: ESD Diode Suppressors Bidirectional 3.3V working voltage 0201; Manufacturer 1: ROHM Semiconductor; Manufacturer 1 Prt. Nr.: VS3V3BA1EST15R
R8 = RES_0201_22R_1%: Thick Film Resistors - SMD 22R OHM 1%; Manufacturer 1: Yageo; Manufacturer 1 Prt. Nr.: RC0201FR-0722RL; Manufacturer 2 Prt. Nr.: CRCW020122R0FNED; Manufacturer 2: Vishay / Dale
R9 = RES_0201_402R_1%: Thick Film Resistors - SMD 402 OHM 1%; Manufacturer 1: Yageo; Manufacturer 1 Prt. Nr.: AC0201FR-07402RL; Manufacturer 2 Prt. Nr.: CRCW0201402RFKED; Manufacturer 2: Vishay / Dale
R12-R15 = RES_0201_2.1k_1%: Thick Film Resistors - SMD 2.1K OHM 1%; Manufacturer 1: Panasonic; Manufacturer 1 Prt. Nr.: ERJ-1GNF2101C; Manufacturer 2 Prt. Nr.: RC0201FR-072K1L; Manufacturer 2: Yageo
R16-R18 R24 R26-R29 = RES_0201_100k_1%: as R4 on sheet 02_8MPLUS_PMIC; Manufacturer 2: Vishay / Dale
R19 = RES_0201_2.4k_1%: Thick Film Resistors - SMD 2.4K OHM 1%; Manufacturer 1: Bourns; Manufacturer 1 Prt. Nr.: CR0201AFW-2401GAS; Manufacturer 2 Prt. Nr.: RC0201FR-072K4L; Manufacturer 2: Yageo
R20-R23 R112 = RES_0201_0R_1%: as R1 on sheet 02_8MPLUS_PMIC; Manufacturer 2: Vishay / Dale
R30 = RES_0201_10k_1%: as R10 on sheet 04_8MPLUS_DRAM; Manufacturer 2: Vishay / Dale
SW1 = SW_TACTILE_EVQ-P7J01P: SMD Switch Tactile SMD 3.2mm X 2.9mm; Manufacturer 1: Panasonic; Manufacturer 1 Prt. Nr.: EVQ-P7J01P
SW2 = SW_DIP_97C04SRT: SMD Switch DIP SMD 1.27mm 4 Pos.; Manufacturer 1: Grayhill Inc.; Manufacturer 1 Prt. Nr.: 97C04SRT; Temperature Range: -40°C - 85°C
U2 = SoC_i.MX 8M Plus_Quad: as U2 on sheet 03_8MPLUS_PWR; Manufacturer 1 Prt. Nr.: MIMX8ML8CVNKZAB
U20 = MEMS Oscillator_Microchip_DSC1001DI5-024.0000: 1.8V-3.3V Low-Power Precision CMOS Oscillators / Stability: ±10 ppm / Output load: 10pF; Manufacturer 1: Microchip Technology; Manufacturer 1 Prt. Nr.: DSC1001DI5-024.0000